# EAGLE design DroneMainBoard (EAGLE 9.6.2)

## Sheet 1 of 6
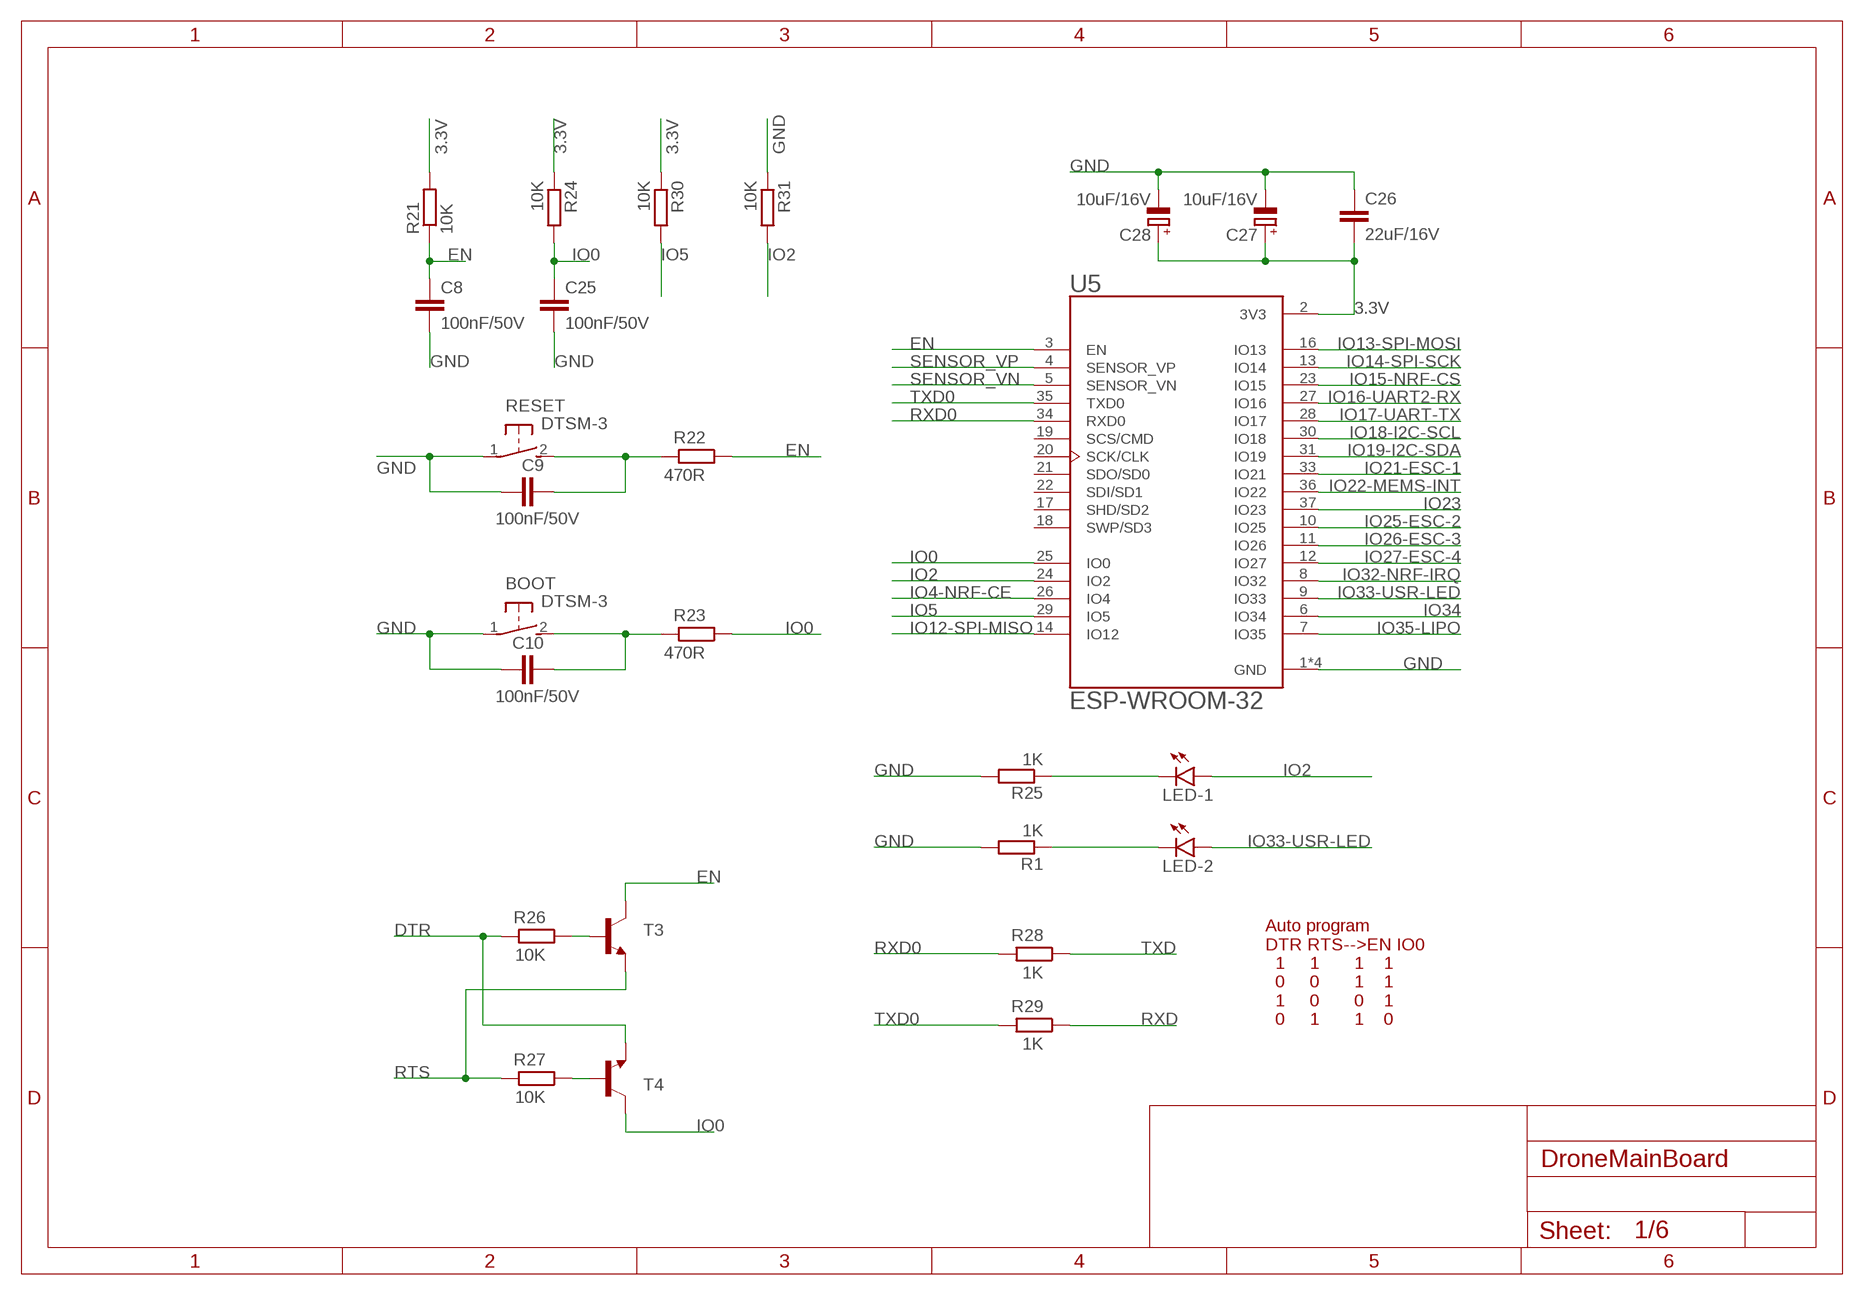
[diagram p0: schematic, sheet 1]

### Parts
BOOT  DTSM-3  [DTSM-3]
C8  100nF/50V  C-EUC0805  [C0805]
C9  100nF/50V  C-EUC0805  [C0805]
C10  100nF/50V  C-EUC0805  [C0805]
C25  100nF/50V  C-EUC0805  [C0805]
C26  22uF/16V  C-EUC0805  [C0805]
C27  10uF/16V  CPOL-EUSMCA  [SMC_A]
C28  10uF/16V  CPOL-EUSMCA  [SMC_A]
LED-1  LEDCHIP-LED0805  [CHIP-LED0805]
LED-2  LEDCHIP-LED0805  [CHIP-LED0805]
R1  1K  R-EU_R0805  [R0805]
R21  10K  R-EU_R0805  [R0805]
R22  470R  R-EU_R0805  [R0805]
R23  470R  R-EU_R0805  [R0805]
R24  10K  R-EU_R0805  [R0805]
R25  1K  R-EU_R0805  [R0805]
R26  10K  R-EU_R0805  [R0805]
R27  10K  R-EU_R0805  [R0805]
R28  1K  R-EU_R0805  [R0805]
R29  1K  R-EU_R0805  [R0805]
R30  10K  R-EU_R0805  [R0805]
R31  10K  R-EU_R0805  [R0805]
RESET  DTSM-3  [DTSM-3]
T3  -NPN-SOT23-EBC  [SOT23-EBC]
T4  -NPN-SOT23-EBC  [SOT23-EBC]
U5  ESP-WROOM-32  [MODULE_ESP-WROOM-32]

### Nets
3.3V: C26.2 C27.+ C28.+ R21.2 R24.1 R30.1 U5.2(3V3) ; also sheet 2,3,4,5,6
DTR: R26.2 T4.E ; also sheet 2
EN: C8.1 R21.1 R22.1 T3.C U5.3(EN)
GND: BOOT.1 C8.2 C9.1 C10.1 C25.2 C26.1 C27.- C28.- R1.2 R25.2 R31.1 RESET.1 U5.1(GND) U5.1.1(GND) U5.15(GND) U5.38(GND) ; also sheet 2,3,4,5,6
IO0: C25.1 R23.1 R24.2 T4.C U5.25(IO0)
IO2: LED-1.A R31.2 U5.24(IO2)
IO4-NRF-CE: U5.26(IO4) ; also sheet 3
IO5: R30.2 U5.29(IO5)
IO12-SPI-MISO: U5.14(IO12) ; also sheet 3
IO13-SPI-MOSI: U5.16(IO13) ; also sheet 3
IO14-SPI-SCK: U5.13(IO14) ; also sheet 3
IO15-NRF-CS: U5.23(IO15) ; also sheet 3
IO16-UART2-RX: U5.27(IO16)
IO17-UART-TX: U5.28(IO17)
IO18-I2C-SCL: U5.30(IO18) ; also sheet 4,5
IO19-I2C-SDA: U5.31(IO19) ; also sheet 4,5
IO21-ESC-1: U5.33(IO21) ; also sheet 6
IO22-MEMS-INT: U5.36(IO22) ; also sheet 4
IO23: U5.37(IO23)
IO25-ESC-2: U5.10(IO25) ; also sheet 6
IO26-ESC-3: U5.11(IO26) ; also sheet 6
IO27-ESC-4: U5.12(IO27) ; also sheet 6
IO32-NRF-IRQ: U5.8(IO32) ; also sheet 3
IO33-USR-LED: LED-2.A U5.9(IO33)
IO34: U5.6(IO34)
IO35-LIPO: U5.7(IO35) ; also sheet 6
N$5: LED-2.C R1.1
N$22: BOOT.2 C10.2 R23.2
N$23: R26.1 T3.B
N$24: R27.1 T4.B
N$25: LED-1.C R25.1
N$26: C9.2 R22.2 RESET.2
RTS: R27.2 T3.E ; also sheet 2
RXD: R29.1 ; also sheet 2
RXD0: R28.2 U5.34(RXD0)
SENSOR_VN: U5.5(SENSOR_VN)
SENSOR_VP: U5.4(SENSOR_VP)
TXD: R28.1 ; also sheet 2
TXD0: R29.2 U5.35(TXD0)
Unconnected: U5.17(SHD/SD2) U5.18(SWP/SD3) U5.19(SCS/CMD) U5.20(SCK/CLK) U5.21(SDO/SD0) U5.22(SDI/SD1)

### Notes on the sheet
- Auto program
  DTR RTS-->EN IO0
    1     1       1    1
    0     0       1    1
    1     0       0    1
    0     1       1    0

## Sheet 2 of 6
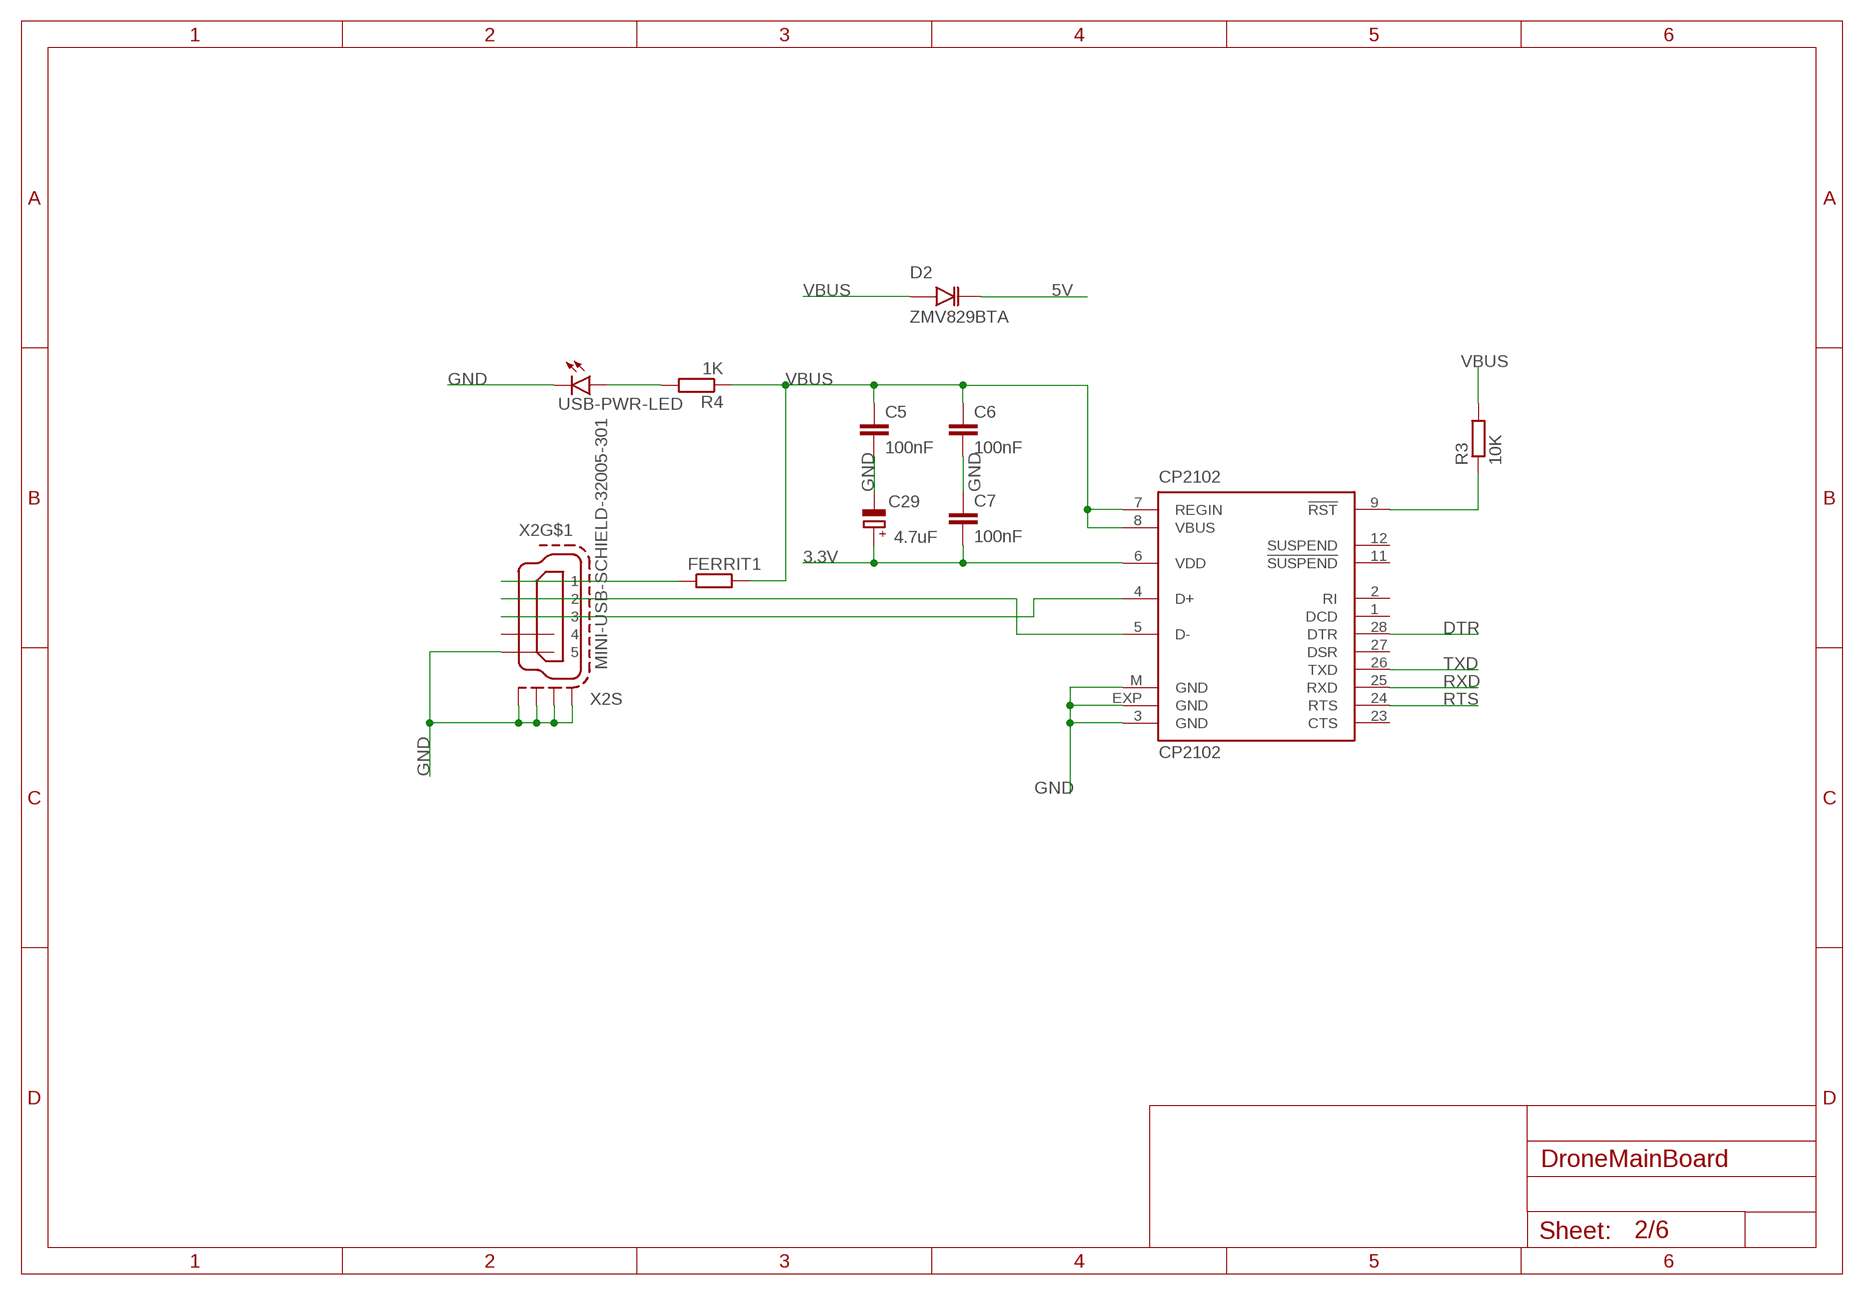
[diagram p1: schematic, sheet 2]

### Parts
C5  100nF  C-EUC0805  [C0805]
C6  100nF  C-EUC0805  [C0805]
C7  100nF  C-EUC0805  [C0805]
C29  4.7uF  CPOL-EUSMCA  [SMC_A]
CP2102  CP2102  [MLP28]
D2  ZMV829BTA  [SOD2512X116N]
FERRIT1  R-EU_R0805  [R0805]
R3  10K  R-EU_R0805  [R0805]
R4  1K  R-EU_R0805  [R0805]
USB-PWR-LED  LEDCHIPLED_0805  [CHIPLED_0805]
X2  MINI-USB-SCHIELD-32005-301  [32005-301]

### Nets
3.3V: C7.2 C29.+ CP2102.6(VDD) ; also sheet 1,3,4,5,6
5V: D2.K ; also sheet 6
DTR: CP2102.28(DTR) ; also sheet 1
GND: C5.2 C6.2 C7.1 C29.- CP2102.3(GND) CP2102.EXP(GND) CP2102.M(GND) USB-PWR-LED.C X2.5 X2.M1(S:S1) X2.M2(S:S2) X2.M3(S:S3) X2.M4(S:S4) ; also sheet 1,3,4,5,6
N$21: CP2102.9(!RST) R3.1
N$27: FERRIT1.1 X2.1
N$28: CP2102.5(D-) X2.2
N$29: CP2102.4(D+) X2.3
N$30: R4.2 USB-PWR-LED.A
RTS: CP2102.24(RTS) ; also sheet 1
RXD: CP2102.25(RXD) ; also sheet 1
TXD: CP2102.26(TXD) ; also sheet 1
VBUS: C5.1 C6.1 CP2102.7(REGIN) CP2102.8(VBUS) D2.A FERRIT1.2 R3.2 R4.1
Unconnected: CP2102.1(DCD) CP2102.2(RI) CP2102.11(!SUSPEND) CP2102.12(SUSPEND) CP2102.23(CTS) CP2102.27(DSR) X2.4

## Sheet 3 of 6
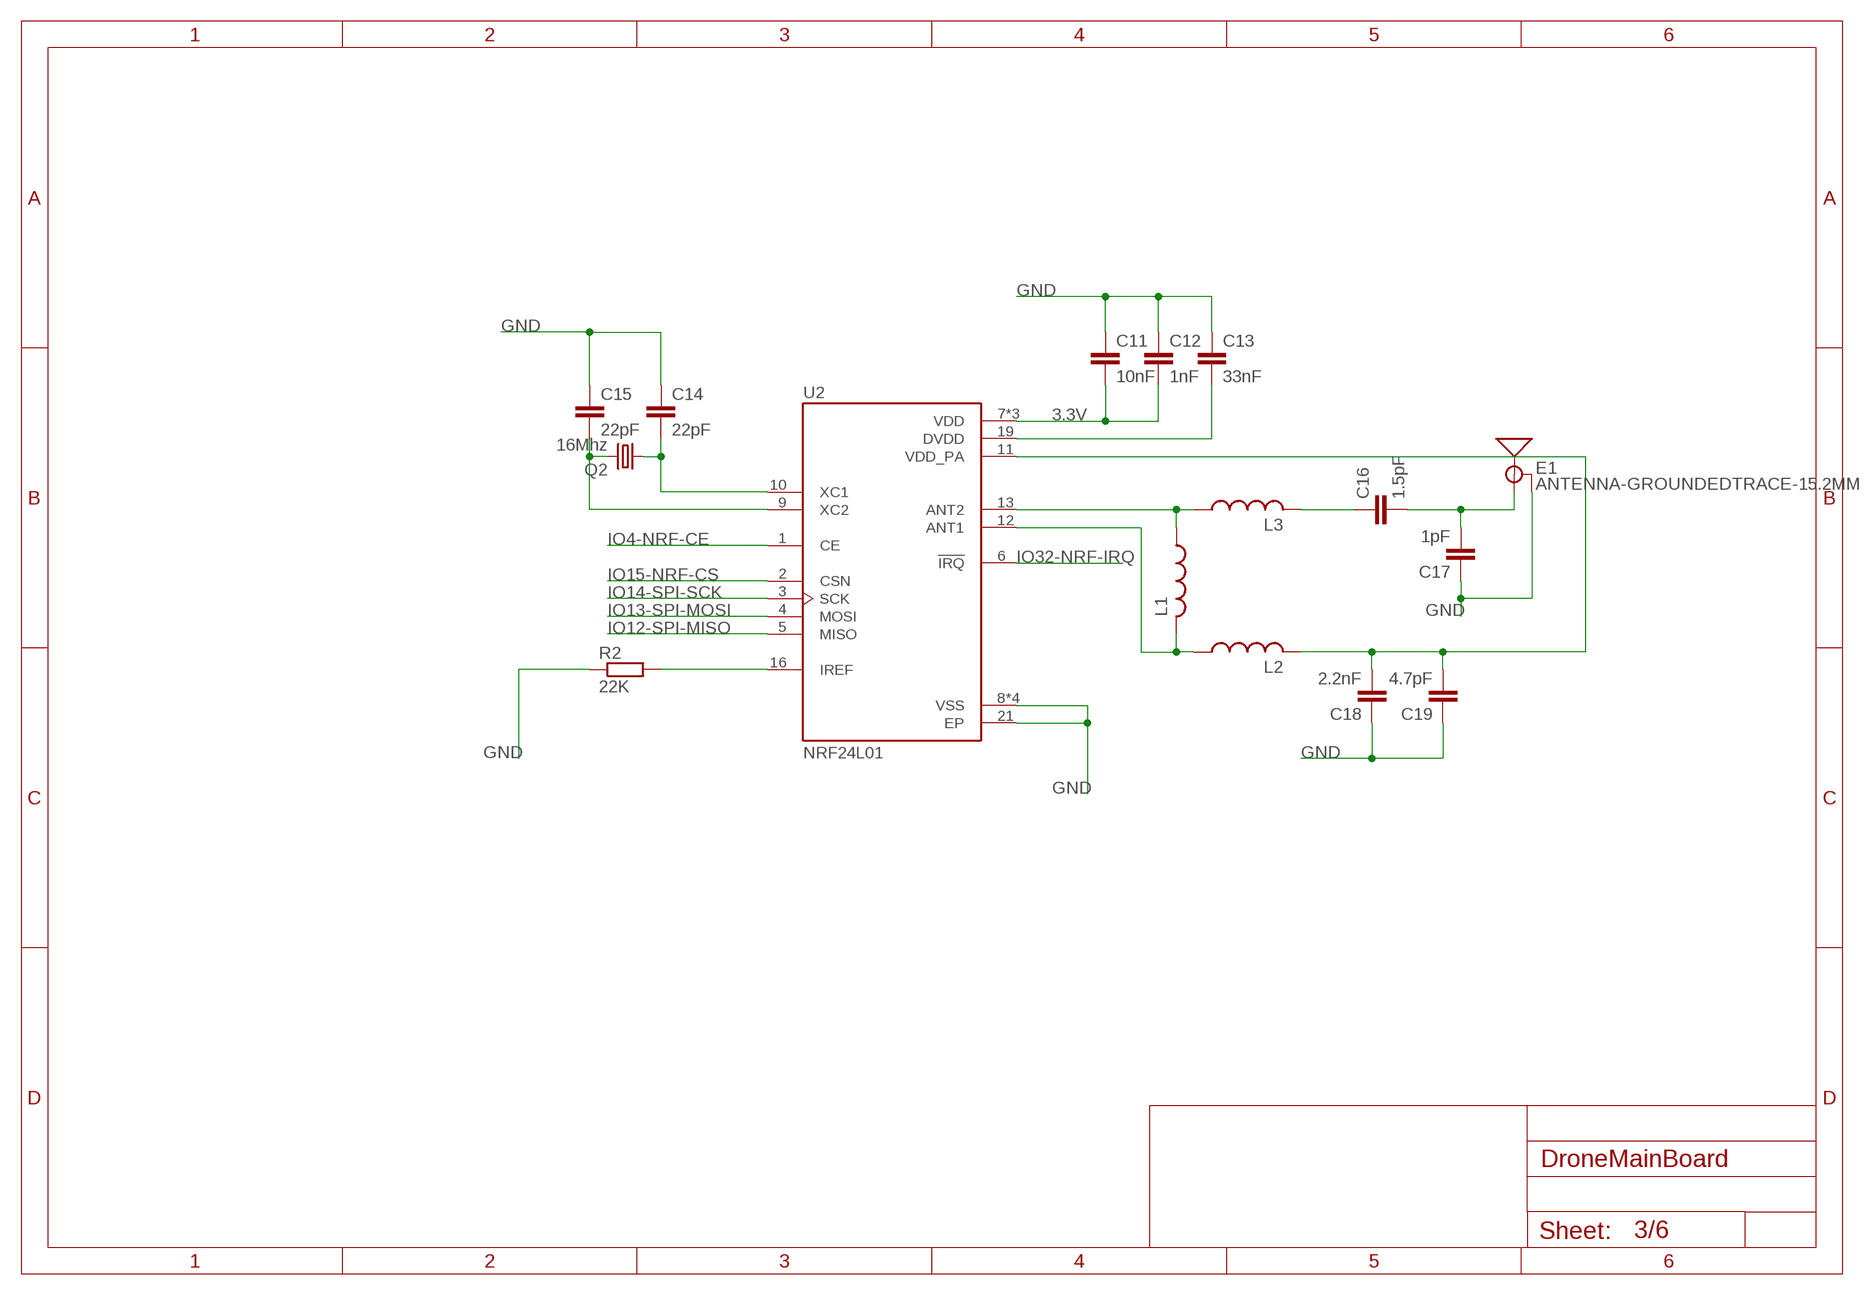
[diagram p2: schematic, sheet 3]

### Parts
C11  10nF  C-EUC0805  [C0805]
C12  1nF  C-EUC0805  [C0805]
C13  33nF  C-EUC0805  [C0805]
C14  22pF  C-EUC0805  [C0805]
C15  22pF  C-EUC0805  [C0805]
C16  1.5pF  C-EUC0805  [C0805]
C17  1pF  C-EUC0805  [C0805]
C18  2.2nF  C-EUC0805  [C0805]
C19  4.7pF  C-EUC0805  [C0805]
E1  ANTENNA-GROUNDEDTRACE-15.2MM  [TRACE_ANTENNA_2.4GHZ_15.2MM]
L1  L-USL2012C  [L2012C]
L2  L-USL2012C  [L2012C]
L3  L-USL2012C  [L2012C]
Q2  16Mhz  CRYSTALHC49S  [HC49/S]
R2  22K  R-EU_R0805  [R0805]
U2  NRF24L01  [QFN50P400X400X95-21N]

### Nets
3.3V: C11.2 C12.2 U2.7(VDD) U2.15(VDD) U2.18(VDD) ; also sheet 1,2,4,5,6
GND: C11.1 C12.1 C13.1 C14.1 C15.1 C17.1 C18.1 C19.1 E1.GND R2.1 U2.8(VSS) U2.14(VSS) U2.17(VSS) U2.20(VSS) U2.21(EP) ; also sheet 1,2,4,5,6
IO4-NRF-CE: U2.1(CE) ; also sheet 1
IO12-SPI-MISO: U2.5(MISO) ; also sheet 1
IO13-SPI-MOSI: U2.4(MOSI) ; also sheet 1
IO14-SPI-SCK: U2.3(SCK) ; also sheet 1
IO15-NRF-CS: U2.2(CSN) ; also sheet 1
IO32-NRF-IRQ: U2.6(!IRQ) ; also sheet 1
N$3: C14.2 Q2.1 U2.10(XC1)
N$4: C15.2 Q2.2 U2.9(XC2)
N$7: C16.2 C17.2 E1.ANT(SIGNAL)
N$9: R2.2 U2.16(IREF)
N$11: C13.2 U2.19(DVDD)
N$12: C18.2 C19.2 L2.2 U2.11(VDD_PA)
N$13: L1.1 L3.1 U2.13(ANT2)
N$14: L1.2 L2.1 U2.12(ANT1)
N$17: C16.1 L3.2

## Sheet 4 of 6
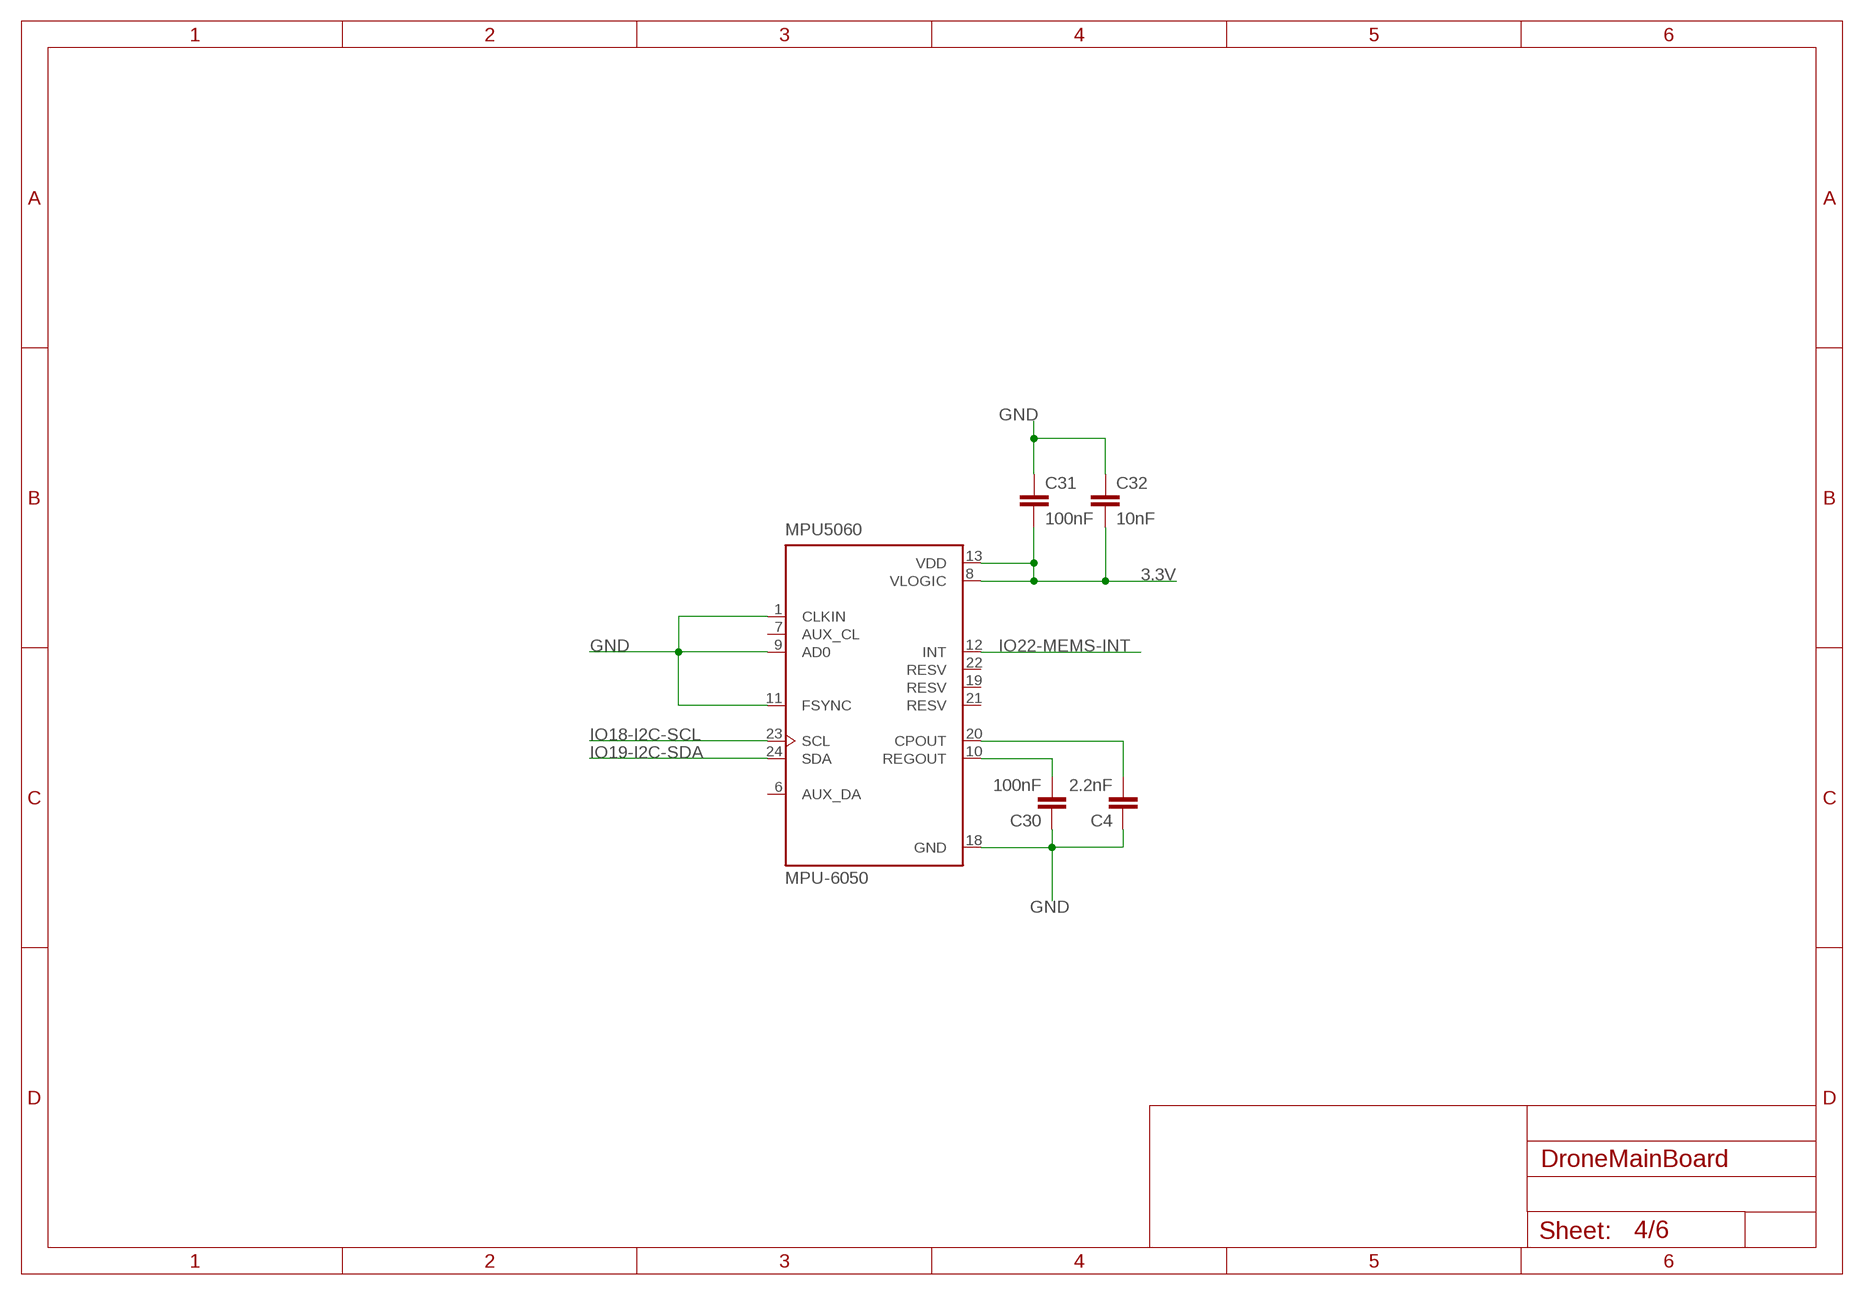
[diagram p3: schematic, sheet 4]

### Parts
C4  2.2nF  C-EUC0805  [C0805]
C30  100nF  C-EUC0805  [C0805]
C31  100nF  C-EUC0805  [C0805]
C32  10nF  C-EUC0805  [C0805]
MPU5060  MPU-6050  [QFN50P400X400X95-24N]

### Nets
3.3V: C31.2 C32.2 MPU5060.8(VLOGIC) MPU5060.13(VDD) ; also sheet 1,2,3,5,6
GND: C4.1 C30.1 C31.1 C32.1 MPU5060.1(CLKIN) MPU5060.9(AD0) MPU5060.11(FSYNC) MPU5060.18(GND) ; also sheet 1,2,3,5,6
IO18-I2C-SCL: MPU5060.23(SCL) ; also sheet 1,5
IO19-I2C-SDA: MPU5060.24(SDA) ; also sheet 1,5
IO22-MEMS-INT: MPU5060.12(INT) ; also sheet 1
N$10: C30.2 MPU5060.10(REGOUT)
N$15: C4.2 MPU5060.20(CPOUT)
Unconnected: MPU5060.6(AUX_DA) MPU5060.7(AUX_CL) MPU5060.19(RESV) MPU5060.21(RESV) MPU5060.22(RESV)

## Sheet 5 of 6
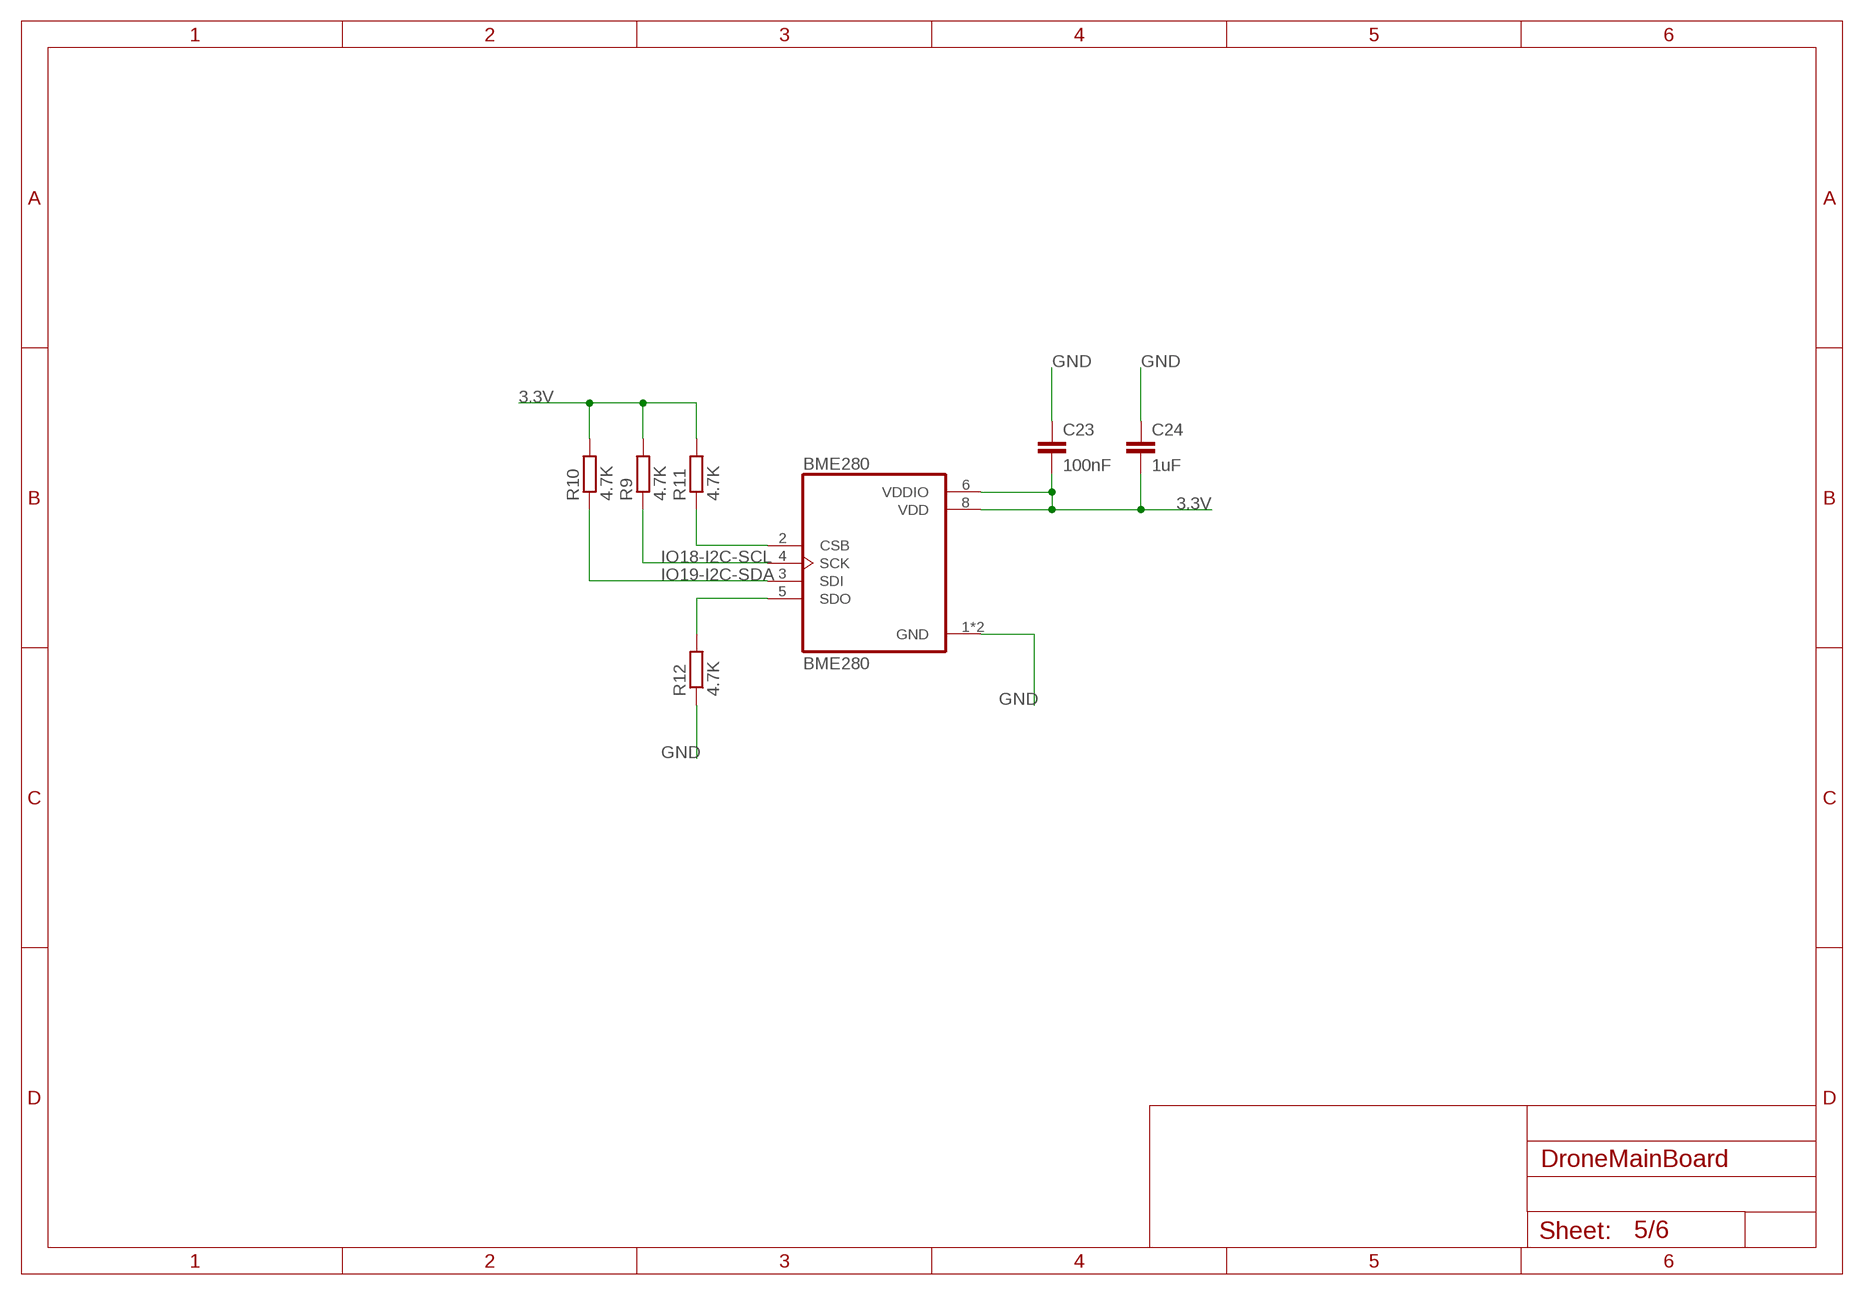
[diagram p4: schematic, sheet 5]

### Parts
BME280  BME280  [PSON65P250X250X100-8N]
C23  100nF  C-EUC0805  [C0805]
C24  1uF  C-EUC0805  [C0805]
R9  4.7K  R-EU_R0805  [R0805]
R10  4.7K  R-EU_R0805  [R0805]
R11  4.7K  R-EU_R0805  [R0805]
R12  4.7K  R-EU_R0805  [R0805]

### Nets
3.3V: BME280.6(VDDIO) BME280.8(VDD) C23.2 C24.2 R9.2 R10.2 R11.2 ; also sheet 1,2,3,4,6
GND: BME280.1(GND) BME280.7(GND) C23.1 C24.1 R12.1 ; also sheet 1,2,3,4,6
IO18-I2C-SCL: BME280.4(SCK) R9.1 ; also sheet 1,4
IO19-I2C-SDA: BME280.3(SDI) R10.1 ; also sheet 1,4
N$8: BME280.2(CSB) R11.1
N$19: BME280.5(SDO) R12.2

## Sheet 6 of 6
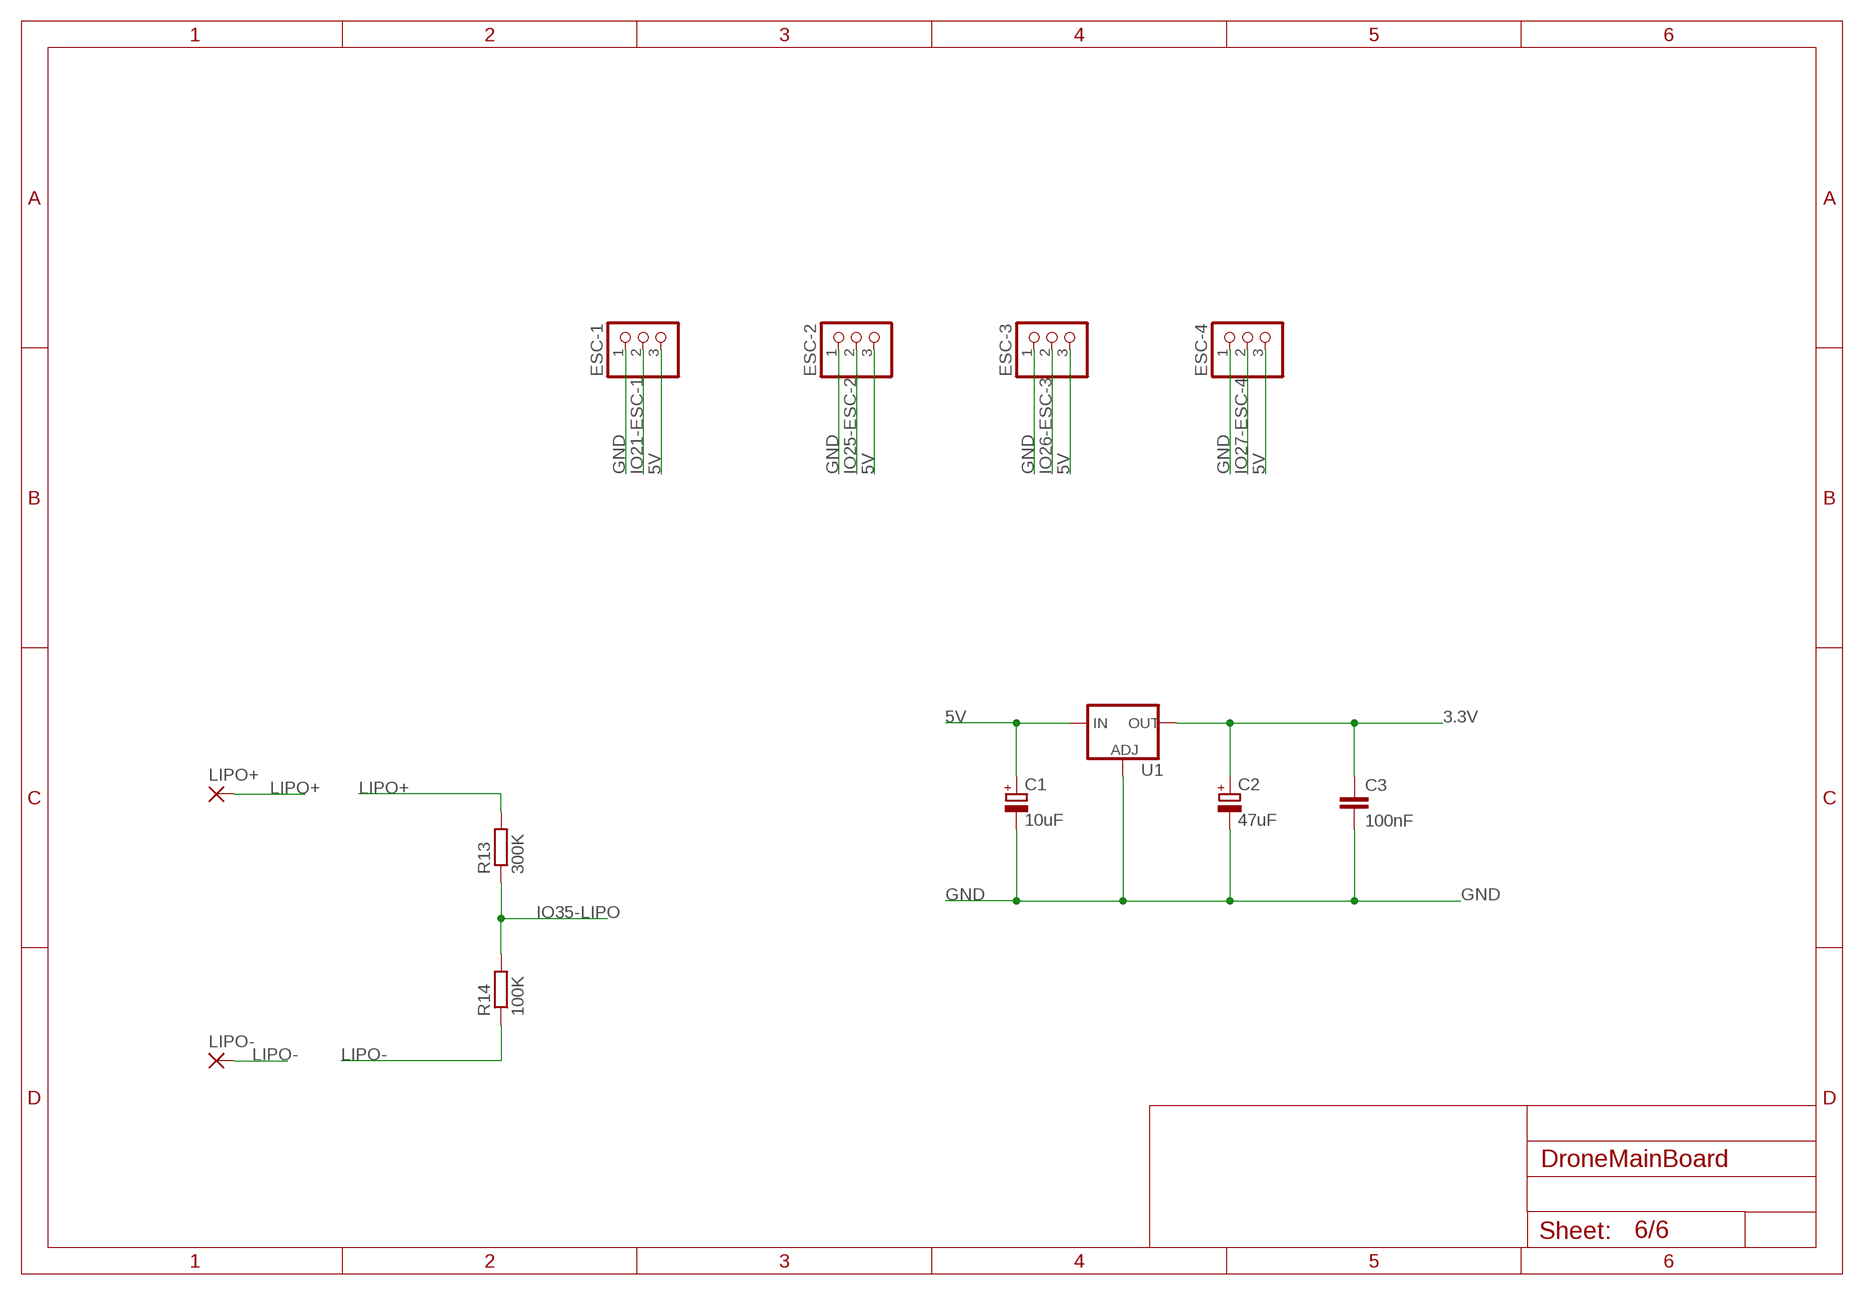
[diagram p5: schematic, sheet 6]

### Parts
C1  10uF  CPOL-EUSMCA  [SMC_A]
C2  47uF  CPOL-EUSMCA  [SMC_A]
C3  100nF  C-EUC0805  [C0805]
ESC-1  PINHD-1X3  [1X03]
ESC-2  PINHD-1X3  [1X03]
ESC-3  PINHD-1X3  [1X03]
ESC-4  PINHD-1X3  [1X03]
LIPO+  2,15/1,0  [2,15/1,0]
LIPO-  2,15/1,0  [2,15/1,0]
R13  300K  R-EU_R0805  [R0805]
R14  100K  R-EU_R0805  [R0805]
U1  V_REG_LM1117SOT223  [SOT223]

### Nets
3.3V: C2.+ C3.1 U1.2(OUT) U1.4(OUT) ; also sheet 1,2,3,4,5
5V: C1.+ ESC-1.3 ESC-2.3 ESC-3.3 ESC-4.3 U1.3(IN) ; also sheet 2
GND: C1.- C2.- C3.2 ESC-1.1 ESC-2.1 ESC-3.1 ESC-4.1 U1.1(ADJ) ; also sheet 1,2,3,4,5
IO21-ESC-1: ESC-1.2 ; also sheet 1
IO25-ESC-2: ESC-2.2 ; also sheet 1
IO26-ESC-3: ESC-3.2 ; also sheet 1
IO27-ESC-4: ESC-4.2 ; also sheet 1
IO35-LIPO: R13.1 R14.2 ; also sheet 1
LIPO+: LIPO+.1(P) R13.2
LIPO-: LIPO-.1(P) R14.1

## Library data of the parts
BME280 = BME280:BME280: DIGITAL HUMIDITY, PRESSURE AND TEMPERATURE SENSOR * Digital interface I²C (up to 3.4 MHz) and SPI (3 and 4 wire, up to 10 MHz)* Supply voltage VDD main supply voltage range: 1.71 V to 3.6 V*VDDIO interface voltage range: 1.2 V to 3.6 V Operating range -40…+85 °C, 0…100 % rel. humidity, 300…1100 hPa The library has been designed by Richard Magdycz <https://www.facebook.com/groups/eaglecadsoftUK> Check prices <https://pricing.snapeda.com/parts/BME280/Bosch/view-part?ref=eda>; AVAILABILITY: Good; DESCRIPTION: Humidity Temperature Sensor 0 ~ 100% RH I²C, SPI ±3% 1s Surface Mount; MF: Bosch; MP: BME280; PACKAGE: LGA-8 Bosch; PRICE: None; PURCHASE-URL: https://pricing.snapeda.com/search/part/BME280/?ref=eda
BOOT RESET = switch-tact:DTSM-3
C1 C2 C27-C29 = rcl:CPOL-EU: POLARIZED CAPACITOR, European symbol; SPICEPREFIX: C
C3-C19 C23-C26 C30-C32 = rcl:C-EU: CAPACITOR, European symbol; SPICEPREFIX: C
CP2102 = silabs:CP210*: Single-Chip USB to UART Bridge Source: www.silabs.com .. CP2101.pdf / cp2102.pdf; MF: FARNELL; MPN: CP2102-GM; OC_FARNELL: 9282130; OC_NEWARK: 30K5635
D2 = ZMV829BTA:ZMV829BTA: Varactors Single 25V Surface Mount SOD-323 Check prices <https://pricing.snapeda.com/search/part/ZMV829BTA/?ref=eda>; AVAILABILITY: Bad; DESCRIPTION: Varactors Single 25V Surface Mount SOD-323; MF: Diodes Inc.; MP: ZMV829BTA; PACKAGE: SOD-323 Diodes Inc.; PRICE: None
E1 = SparkFun-RF:ANTENNA-GROUNDED: Antenna w/ Ground Connection 2.4GHz antennae with signal and ground terminals. TRACE_ANTENNA_2.4GHZ_15.2MM - Meander Trace antenna 15.2 x 5.7mm footprint Based on layout from TI app note AN043 <http://www.ti.com/lit/an/swra117d/swra117d.pdf>. TRACE_ANTENNA_2.4GHZ_25.7MM - Inverted F trace antenna 25.7 x 7.5 mm footprint. Based on layout from TI design note DN0007 <http://www.ti.com/lit/an/swru120b/swru120b.pdf>.
ESC-1-ESC-4 = pinhead:PINHD-1X3: PIN HEADER
FERRIT1 R1-R4 R9-R14 R21-R31 = rcl:R-EU_: RESISTOR, European symbol; SPICEPREFIX: R
L1-L3 = rcl:L-US: INDUCTOR, American symbol; SPICEPREFIX: L
LED-1 LED-2 USB-PWR-LED = led:LED: LED OSRAM: - CHIPLED LG R971, LG N971, LY N971, LG Q971, LY Q971, LO R971, LY R971 LH N974, LH R974 LS Q976, LO Q976, LY Q976 LO Q996 - Hyper CHIPLED LW Q18S LB Q993, LB Q99A, LB R99A - SideLED LS A670, LO A670, LY A670, LG A670, LP A670 LB A673, LV A673, LT A673, LW A673 LH A674 LY A675 LS A676, LA A676, LO A676, LY A676, LW A676 LS A679, LY A679, LG A679 - Hyper Micro SIDELED® LS Y876, LA Y876, LO Y876, LY Y876 LT Y87S - SmartLED LW L88C, LW L88S LB L89C, LB L89S, LG L890 LS L89K, LO L89K, LY L89K LS L896, LA L896, LO L896, LY L896 - TOPLED LS T670, LO T670, LY T670, LG T670, LP T670 LSG T670, LSP T670, LSY T670, LOP T670, LYG T670 LG T671, LOG T671, LSG T671 LB T673, LV T673, LT T673, LW T673 LH T674 LS T676, LA T676, LO T676, LY T676, LB T676, LH T676, LSB T676, LW T676 LB T67C, LV T67C, LT T67C, LS T67K, LO T67K, LY T67K, LW E67C LS E67B, LA E67B, LO E67B, LY E67B, LB E67C, LV E67C, LT E67C LW T67C LS T679, LY T679, LG T679 LS T770, LO T770, LY T770, LG T770, LP T770 LB T773, LV T773, LT T773, LW T773 LH T774 LS E675, LA E675, LY E675, LS T675 LS T776, LA T776, LO T776, LY T776, LB T776 LHGB T686 LT T68C, LB T68C - Hyper Mini TOPLED® LB M676 - Mini TOPLED Santana® LG M470 LS M47K, LO M47K, LY M47K Source: http://www.osram.convergy.de LUXEON: - LUMILED® LXK2-PW12-R00, LXK2-PW12-S00, LXK2-PW14-U00, LXK2-PW14-V00 LXK2-PM12-R00, LXK2-PM12-S00, LXK2-PM14-U00 LXK2-PE12-Q00, LXK2-PE12-R00, LXK2-PE12-S00, LXK2-PE14-T00, LXK2-PE14-U00 LXK2-PB12-K00, LXK2-PB12-L00, LXK2-PB12-M00, LXK2-PB14-N00, LXK2-PB14-P00, LXK2-PB14-Q00 LXK2-PR12-L00, LXK2-PR12-M00, LXK2-PR14-Q00, LXK2-PR14-R00 LXK2-PD12-Q00, LXK2-PD12-R00, LXK2-PD12-S00 LXK2-PH12-R00, LXK2-PH12-S00 LXK2-PL12-P00, LXK2-PL12-Q00, LXK2-PL12-R00 Source: www.luxeon.com KINGBRIGHT: KA-3528ASYC Source: www.kingbright.com
LIPO+ LIPO- = wirepad:2,15/1,0: THROUGH-HOLE PAD
MPU5060 = MPU-6050:MPU-6050: MPU-6050 Six-Axis (Gyro + Accelerometer) MEMS MotionTracking™ Devices Check prices <https://pricing.snapeda.com/parts/MPU-6050/TDK%20InvenSense/view-part?ref=eda>; AVAILABILITY: Warning; DESCRIPTION: Accelerometer, Gyroscope, 6 Axis Sensor I²C Output; MF: TDK InvenSense; MP: MPU-6050; PACKAGE: VFQFN-24 TDK InvenSense; PRICE: None; PURCHASE-URL: https://pricing.snapeda.com/search/part/MPU-6050/?ref=eda
Q2 = crystal:CRYSTAL: CRYSTAL; OC_FARNELL: 1667008; OC_NEWARK: unknown
T3 T4 = transistor:*-NPN-: NPN Transistror BF959 corrected 2008.03.06
U1 = SparkFun-IC-Power:V_REG_LM1117: Voltage Regulator LM1117 Standard adjustable voltage regulator but in SMD form. Spark Fun Electronics SKU : COM-00595; PROD_ID: VREG-08170
U2 = NRF24L01:NRF24L01: The nRF24L01 is a single chip 2.4GHz transceiver with an embedded baseband protocol engine (Enhanced ShockBurst™), designed for ultra low power wireless applications. The nRF24L01 is designed for operation in the world wide ISM frequency band at 2.400 - 2.4835GHz. An MCU (microcontroller) and very few external passive components are needed to design a radio system with the nRF24L01. The nRF24L01 is configured and operated through a Serial Peripheral Interface (SPI.) Through this interface the register map is available. The register map contains all configuration registers in the nRF24L01 and is accessible in all operation modes of the chip. Buy Part <https://snapeda.com/parts/NRF24L01/Nordic/view-part/?ref=eda>; AVAILABILITY: Warning; DESCRIPTION: IC RF TxRx Only General ISM > 1GHZ 2.4GHz 20-VFQFN Exposed Pad; MF: Nordic; MOUSER-PURCHASE-URL: https://snapeda.com/shop?store=Mouser&id=44833; MP: NRF24L01; PACKAGE: VFQFN-20 Nordic Semiconductor; PRICE: None
U5 = ESP-WROOM-32:ESP-WROOM-32: Module: combo; GPIO, I2C x2, I2S x2, SDIO, SPI x3, UART x3; 19.5dBm; AVAILABILITY: Unavailable; DESCRIPTION: WiFi 802.11b/g/n/d/e/i Transceiver Module 2.4GHz Surface Mount; MF: Olimex LTD; MP: ESP-WROOM-32; PACKAGE: Module Olimex LTD; PRICE: None
X2 = con-cypressindustries:MINI-USB-SCHIELD-: MINI USB-B Conector Source: www.cypressindustries.com; OC_FARNELL: unknown; OC_NEWARK: unknown

## Board
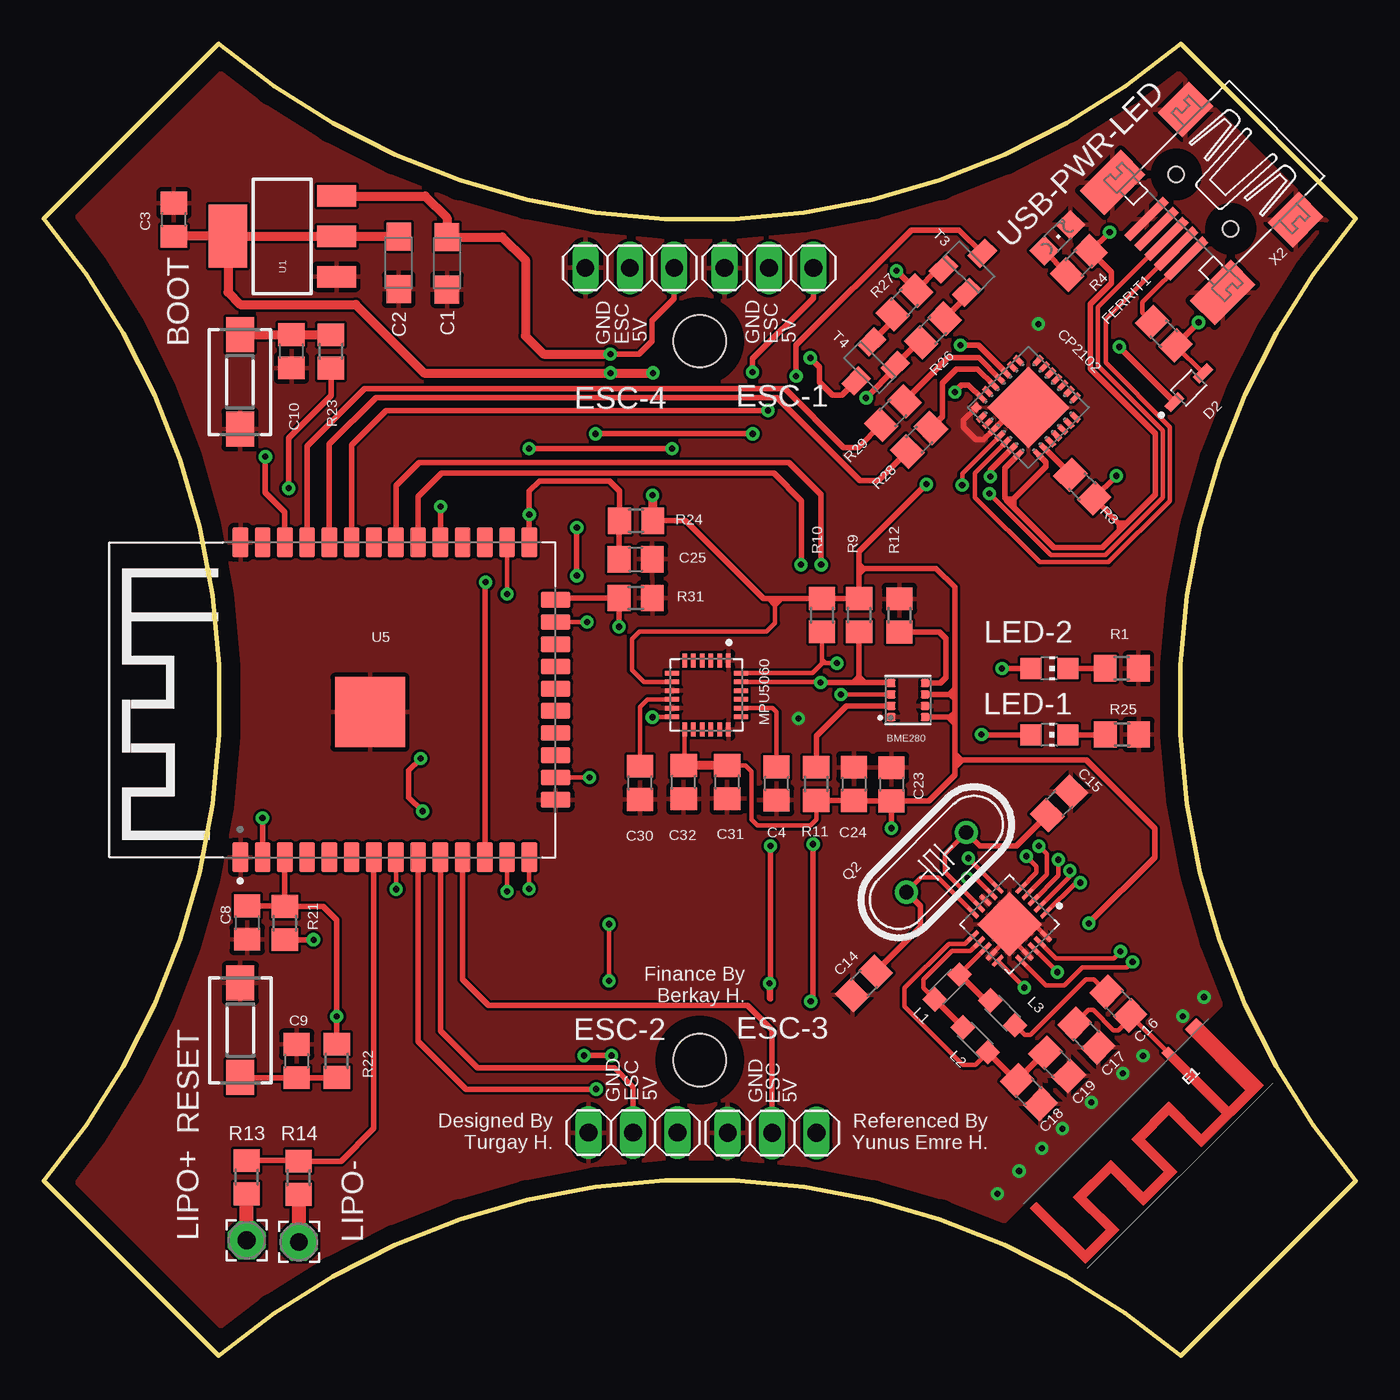
[diagram p6: board, top side]
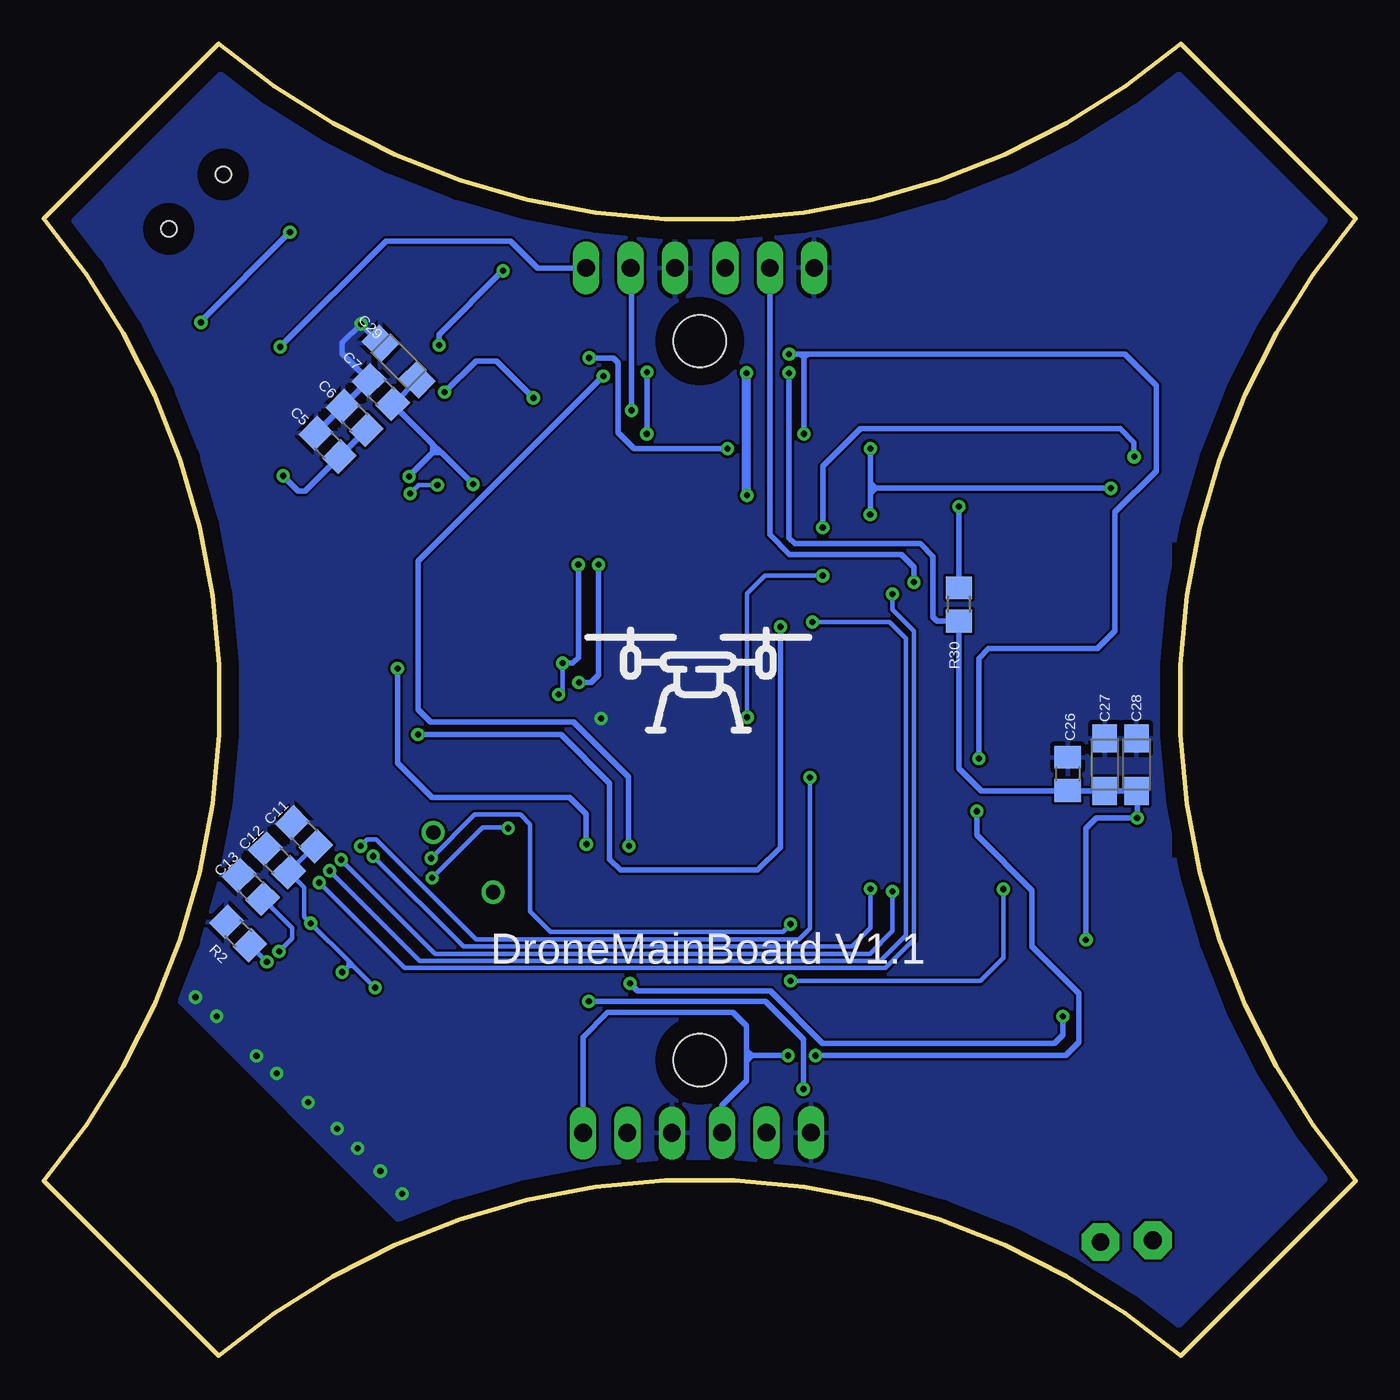
[diagram p7: board, bottom side, seen from below]

Size 75 x 75 mm. Coordinates in mm from the lower left corner, seen from the top.
Outline: 0,10 10,0 arc-80 65,0 75,10 arc-80 75,65 65,75 arc-80 10,75 0,65 arc-80 0,10
Copper layers (1*16): Top 0.035mm / dielectric 1.5mm / Bottom 0.035mm
Design rules "default": minimum track width 6mil, minimum drill 0.35mm, track to track 6mil, track to pad 6mil, pad to pad 6mil, via to via 6mil, smd to smd 6mil, copper to edge 40mil, drill to drill 6mil, minimum pad ring 10mil, minimum via ring 8mil, stop-mask expansion 4mil, vias tented up to drill 0mil, thermal gap 10mil
Holes 3 mm at 37.5,58 37.5,16.9
bKeepout: 1 lines
tRestrict: 1 lines
bRestrict: 1 lines

### Footprints (pad centres in the part's own frame; a part is rotated, then mirrored left to right if it is on the bottom)
PSON65P250X250X100-8N = smd 0.49 x 0.45: 1 0.97,0.975; 2 0.97,0.325; 3 0.97,-0.325; 4 0.97,-0.975; 5 -0.97,-0.975; 6 -0.97,-0.325; 7 -0.97,0.325; 8 -0.97,0.975
DTSM-3 = smd 2 x 1.6: 1 -2.7,0; 2 2.7,0
SMC_A = smd 1.6 x 1.4: + -1.5,0; - 1.5,0
C0805 = smd 1.3 x 1.5: 1 -0.95,0; 2 0.95,0
MLP28 = smd 0.6 x 0.3: 1 -2.3,1.5; 2 -2.3,1; 3 -2.3,0.5; 4 -2.3,0; 5 -2.3,-0.5; 6 -2.3,-1; 7 -2.3,-1.5; 15 2.3,-1.5; 16 2.3,-1; 17 2.3,-0.5; 18 2.3,0; 19 2.3,0.5; 20 2.3,1; 21 2.3,1.5 | smd 0.3 x 0.6: 8 -1.5,-2.3; 9 -1,-2.3; 10 -0.5,-2.3; 11 0,-2.3; 12 0.5,-2.3; 13 1,-2.3; 14 1.5,-2.3; 22 1.5,2.3; 23 1,2.3; 24 0.5,2.3; 25 0,2.3; 26 -0.5,2.3; 27 -1,2.3; 28 -1.5,2.3 | smd 3.3 x 3.3: EXP 0,0 | smd 0.435 x 0.435: M -2.103,2.103
SOD2512X116N = smd 1.11 x 0.52: A 1.165,0; K -1.165,0
TRACE_ANTENNA_2.4GHZ_15.2MM = smd 0.5 x 0.5: ANT 0,-0.25 | smd 0.9 x 0.5: GND -2.1,-0.25
1X03 = drill 1.016 long: 1 -2.54,0; 2 0,0; 3 2.54,0
R0805 = smd 1.3 x 1.5: 1 -0.95,0; 2 0.95,0
L2012C = smd 1 x 1: 1 -1,0; 2 1,0
CHIP-LED0805 = smd 1.2 x 1.2: A 0,-1.05; C 0,1.05
2,15/1,0 = drill 1.016 pad 2.159 octagon: 1 0,0
QFN50P400X400X95-24N = smd 0.79 x 0.26: 1 -1.97,1.25; 2 -1.97,0.75; 3 -1.97,0.25; 4 -1.97,-0.25; 5 -1.97,-0.75; 6 -1.97,-1.25; 13 1.97,-1.25; 14 1.97,-0.75; 15 1.97,-0.25; 16 1.97,0.25; 17 1.97,0.75; 18 1.97,1.25 | smd 0.26 x 0.79: 7 -1.25,-1.97; 8 -0.75,-1.97; 9 -0.25,-1.97; 10 0.25,-1.97; 11 0.75,-1.97; 12 1.25,-1.97; 19 1.25,1.97; 20 0.75,1.97; 21 0.25,1.97; 22 -0.25,1.97; 23 -0.75,1.97; 24 -1.25,1.97
HC49/S = drill 0.813: 1 -2.413,0; 2 2.413,0
SOT23-EBC = smd 1 x 1.4: B 0.95,-1.1; C 0,1.1; E -0.95,-1.1
SOT223 = smd 1.219 x 2.235: 1 -2.311,-3.099; 2 0,-3.099; 3 2.311,-3.099 | smd 3.6 x 2.2: 4 0,3.099
QFN50P400X400X95-21N = smd 0.81 x 0.26: 1 -1.95,1; 2 -1.95,0.5; 3 -1.95,0; 4 -1.95,-0.5; 5 -1.95,-1; 11 1.95,-1; 12 1.95,-0.5; 13 1.95,0; 14 1.95,0.5; 15 1.95,1 | smd 0.26 x 0.81: 6 -1,-1.95; 7 -0.5,-1.95; 8 0,-1.95; 9 0.5,-1.95; 10 1,-1.95; 16 1,1.95; 17 0.5,1.95; 18 0,1.95; 19 -0.5,1.95; 20 -1,1.95 | smd 2.6 x 2.6: 21 0,0
MODULE_ESP-WROOM-32 = smd 1.7 x 0.9: 1 -9,8.255; 2 -9,6.985; 3 -9,5.715; 4 -9,4.445; 5 -9,3.175; 6 -9,1.905; 7 -9,0.635; 8 -9,-0.635; 9 -9,-1.905; 10 -9,-3.175; 11 -9,-4.445; 12 -9,-5.715; 13 -9,-6.985; 14 -9,-8.255; 25 9,-8.255; 26 9,-6.985; 27 9,-5.715; 28 9,-4.445; 29 9,-3.175; 30 9,-1.905; 31 9,-0.635; 32 9,0.635; 33 9,1.905; 34 9,3.175; 35 9,4.445; 36 9,5.715; 37 9,6.985; 38 9,8.255 | smd 4 x 4: 1.1 -0.7,0.845 | smd 0.9 x 1.7: 15 -5.715,-9.755; 16 -4.445,-9.755; 17 -3.175,-9.755; 18 -1.905,-9.755; 19 -0.635,-9.755; 20 0.635,-9.755; 21 1.905,-9.755; 22 3.175,-9.755; 23 4.445,-9.755; 24 5.715,-9.755
CHIPLED_0805 = smd 1.2 x 1.2: A 0,-1.05; C 0,1.05
32005-301 = smd 3.1 x 0.5: 1 3,1.6; 2 3,0.8; 3 3,0; 4 3,-0.8; 5 3,-1.6 | smd 2.5 x 2: M1 -3,-4.45; M2 -3,4.45 | smd 3.3 x 2: M3 2.9,4.45; M4 2.9,-4.45 | hole 0.9: 0,2.2; 0,-2.2

### Placement (x,y rotation side)
BME280  49.41,37.48 180 top
BOOT  11.22,55.67 90 top
C1  23.05,62.45 270 top
C2  20.29,62.47 270 top
C3  7.44,64.94 90 top
C4  41.89,32.71 90 top
C5  58.77,52.07 135 bottom
C6  57.22,53.61 135 bottom
C7  55.73,55.08 315 bottom
C8  11.63,24.76 270 top
C9  14.45,16.85 270 top
C10  14.16,57.42 90 top
C11  60.12,29.81 315 bottom
C12  61.67,28.32 315 bottom
C13  63.16,26.81 315 bottom
C14  46.89,21.29 45 top
C15  58.04,31.58 225 top
C16  61.43,20.13 315 top
C17  59.61,18.3 135 top
C18  56.31,15.07 135 top
C19  57.93,16.66 135 top
C23  48.46,32.67 270 top
C24  46.31,32.69 270 top
C25  33.83,45.53 0 top
C26  16.47,33.26 270 bottom
C27  14.35,33.79 90 bottom
C28  12.54,33.8 90 bottom
C29  54.71,56.84 135 bottom
C30  34.09,32.75 90 top
C31  39.07,32.8 90 top
C32  36.58,32.79 90 top
CP2102  56.28,54.21 45 top
D2  65.45,55.33 45 top
E1  64.45,17.13 225 top
ESC-1  41.46,62.18 0 top
ESC-2  33.69,12.75 0 top
ESC-3  41.64,12.74 0 top
ESC-4  33.5,62.19 0 top
FERRIT1  64.02,58.42 315 top
L1  51.64,21.08 225 top
L2  53.25,18.06 315 top
L3  54.82,19.6 315 top
LED-1  57.48,35.5 270 top
LED-2  57.49,39.29 270 top
LIPO+  11.6,6.61 0 top
LIPO-  14.59,6.5 0 top
MPU5060  37.88,37.77 270 top
Q2  51.03,28.21 45 top
R1  61.62,39.3 0 top
R2  63.89,24.14 315 bottom
R3  59.36,49.69 315 top
R4  59.17,62.47 225 top
R9  46.61,42.34 90 top
R10  44.49,42.33 90 top
R11  44.16,32.69 270 top
R12  48.91,42.32 270 top
R13  11.6,10.21 270 top
R14  14.57,10.18 90 top
R21  13.78,24.73 270 top
R22  16.75,16.86 270 top
R23  16.42,57.41 90 top
R24  33.86,47.73 180 top
R25  61.64,35.52 0 top
R26  50.82,58.61 225 top
R27  49.2,60.21 45 top
R28  50.04,52.36 225 top
R29  48.54,53.89 225 top
R30  22.69,42.95 90 bottom
R31  33.84,43.32 180 top
RESET  11.24,18.61 270 top
T3  52.88,62.24 315 top
T4  47.22,56.5 135 top
U1  13.64,63.99 90 top
U2  55.21,24.66 225 top
U5  19.5,37.5 90 top
USB-PWR-LED  57.94,63.91 315 top
X2  66.3,65.97 225 top

### Tracks (layer width: path | path; a pad name or v marks a point on that pad's centre or on a via)
3.3V  (via drill 0.35)
  Top 0.254: 56.06,21.05 U2.15 | v57.94,21.93 U2.18 | U2.7 53.27,27.31 52.82,27.31 | MPU5060.13 36.63,33.79 | 36.71,33.87 36.63,33.79 | 36.63,33.79 C32.2 | MPU5060.8 34.3,38.52 33.62,39.2 33.62,40.96 34.05,41.39 41.3,41.39 41.8,41.89 41.8,42.9 | 41.8,43.28 41.8,42.9 | 41.8,42.9 41.42,43.28 | 41.8,42.9 42.08,43.18 42.08,43.28 | C31.2 40.1,33.75 40.46,33.39 40.46,30.65 40.79,30.32 43.82,30.32 44.16,30.66 R11.2
  Top 0.305: CP2102.6 54.12,50.63 54.12,50.29 | R9.2 R10.2 42.08,43.28 41.8,43.28 41.42,43.28 41.13,43.28 36.68,47.73 R24.1 | R9.2 | 15.4,23.78 R21.2 | 12.52,30.73 U5.2 | BME280.6 51.81,37.8 | 52.08,37.53 51.81,37.8 | 52.08,37.53 52.08,36.78 | 52.08,36.78 52.08,36.48 | 52.08,36.48 52.08,36.15 | 52.08,36.15 52.08,34.4 | 52.08,34.4 52.08,34.05 | 52.08,34.05 52.08,33.65 | 52.08,33.65 52.08,33.21 50.59,31.72 C23.2 | BME280.8 51.8,36.5 | 51.8,36.5 52.06,36.5 52.08,36.48 | 51.8,36.5 52.08,36.78 | 51.8,36.5 51.8,36.43 52.08,36.15 | 52.08,34.05 52.43,34.05 | 52.48,34.05 59.59,34.05 63.51,30.13 63.51,28.49 v59.75,24.73 | 52.48,34.05 52.43,34.05 | 52.43,34.05 52.08,34.4 | 52.48,34.05 52.08,33.65 | 52.08,37.53 52.08,38.11 | 52.08,38.11 52.08,43.94 51.01,45.01 46.89,45.01 | 46.89,45.01 46.6,44.72 | 46.6,44.72 R9.2 | 51.81,37.8 51.81,37.84 52.08,38.11 | v50.45,49.81 46.6,45.96 46.6,45.23 | 46.6,45.23 46.6,44.72 | 46.89,45.01 46.82,45.01 46.6,45.23 | C23.2 46.33,31.72 C24.2 R11.2 | 48.46,30.18 C23.2
  Top 0.508: U1.4 C3.1 | U1.4 U1.2 20.27,63.99 C2.+ | U1.4 10.54,60.79 11.24,60.09 17.83,60.09 21.74,56.18 v32.4,56.18 | 32.42,56.18 34.81,56.18 | 34.8,49.17 R24.1 | C31.2 36.83,33.75 36.71,33.87
  Top 0.61: v34.83,56.18 34.81,56.18 | v32.4,56.18 32.42,56.18 | v54.12,50.26 54.12,50.29 | v50.46,49.82 v50.45,49.81 | v34.8,49.19 34.8,49.17 | v12.5,30.74 12.52,30.73 | v15.42,23.78 15.4,23.78 | v52.8,27.31 52.82,27.31 | v59.74,24.73 v59.75,24.73 | v57.95,21.93 v57.94,21.93 | v56.06,21.04 56.06,21.05 | v48.46,30.16 48.46,30.18
  Bottom 0.254: 56.08,21.05 57.31,22.3 | 57.31,22.3 57.47,22.45 | 57.47,22.45 57.59,22.57 | 59.7,24.68 57.59,22.57 | v59.74,24.73 60.12,25.1 60.12,26.77 C12.2 59.51,29.14 C11.2 | v57.95,21.93 57.59,22.3 | 57.59,22.3 57.47,22.41 57.47,22.45 | 57.59,22.3 57.31,22.3 | 57.59,22.3 57.59,22.57 | v52.79,27.32 49.92,30.19 48.49,30.19
  Bottom 0.305: 54.1,50.27 52.76,51.62 | 52.76,52.12 C7.2 55.01,54.41 C29.+ | 52.76,52.12 52.76,51.62 | 12.5,30.76 12.5,32.26 C28.+ C27.+ 16.45,32.29 | 16.45,32.29 C26.2 | 15.42,23.8 15.42,30.15 14.83,30.74 v12.5,30.74 | 16.45,32.29 21.4,32.29 22.69,33.58 R30.1 23.93,42 24.17,42.24 24.17,45.7 24.89,46.42 32.07,46.42 32.39,46.74 v32.39,56.17 | 52.76,52.12 52.26,51.62 | v50.47,49.82 52.26,51.62 | 52.76,51.62 52.26,51.62
  Bottom 0.508: 34.83,49.22 v34.83,56.18
  Bottom 0.61: v32.4,56.18 v32.39,56.17 | v34.8,49.19 34.83,49.22 | v52.8,27.31 v52.79,27.32 | v59.74,24.73 59.7,24.68 | v57.95,21.93 | v56.06,21.04 56.08,21.05 | v15.42,23.78 15.42,23.8 | v12.5,30.74 12.5,30.76 | v54.12,50.26 54.1,50.27 | v50.46,49.82 v50.47,49.82 | v48.46,30.16 48.49,30.19
5V  (via drill 0.35)
  Top 0.305: 61.49,57.65 D2.K | 44,62.16 44,60.47 40.52,56.99 v40.52,56.24 | 31.6,52.7 40.5,52.7 | 32.41,57.26 34.04,57.26 34.77,57.99 34.77,59.17 36.04,60.44 36.04,62.16 | 21.54,34.12 20.87,33.45 20.87,31.92 v21.65,31.14 | 30.92,17.16 32.43,17.16
  Top 0.508: U1.3 21.8,66.3 23.05,65.05 C1.+ 26.21,63.95 27.53,62.63 27.53,58.3 28.57,57.26 v32.39,57.26
  Top 0.61: v32.39,57.26 32.41,57.26 | v40.52,56.23 v40.52,56.24 | v61.49,57.67 61.49,57.65 | v40.53,52.7 40.5,52.7 | v31.55,52.7 31.6,52.7 | v21.54,34.14 21.54,34.12 | v21.66,31.13 v21.65,31.14 | v32.45,17.16 32.43,17.16 | v30.89,17.16 30.92,17.16
  Top 1.27: ESC-1.3 44,62.16 | ESC-4.3 36.04,62.16
  Bottom 0.305: v61.48,57.68 55.44,63.72 48.32,63.72 46.78,62.18 44.02,62.18 | v40.52,56.22 v40.52,52.71 | 31.55,52.72 31.55,57.05 | 31.76,57.26 32.37,57.26 | 31.76,57.26 31.55,57.05 | 36.23,12.79 36.23,14.32 34.83,15.72 34.83,16.85 | 44.18,12.83 44.18,18.21 42.76,19.63 35.59,19.63 34.83,18.87 34.83,17.47 | 34.83,16.85 34.83,17.03 | 34.83,17.03 34.83,17.47 | 31.76,57.26 31.32,57.26 | 31.32,57.26 13.21,57.26 11.41,55.46 11.41,50.58 13.77,48.22 13.77,41.43 14.78,40.42 20.99,40.42 21.54,39.87 21.54,34.17 | 21.66,31.09 21.66,29.76 18.51,26.61 18.51,23.4 15.82,20.71 15.82,17.92 16.58,17.16 30.87,17.16 | 34.83,17.03 34.7,17.16 34.52,17.16 | 32.51,17.16 34.52,17.16 | 34.52,17.16 34.83,17.47 | 34.52,17.16 34.83,16.85 | 31.55,57.05 31.53,57.05 31.32,57.26
  Bottom 0.61: v31.55,52.7 31.55,52.72 | v40.53,52.7 v40.52,52.71 | v40.52,56.23 v40.52,56.22 | v61.49,57.67 v61.48,57.68 | v32.39,57.26 32.37,57.26 | v21.66,31.13 21.66,31.09 | v21.54,34.14 21.54,34.17 | v30.89,17.16 30.87,17.16 | v32.45,17.16 32.51,17.16
  Bottom 1.27: ESC-1.3 44.02,62.18 | ESC-2.3 36.23,12.79 | ESC-3.3 44.18,12.83
DTR  (via drill 0.35)
  Top 0.305: CP2102.28 52.87,55.5 52.47,55.5 52.09,55.12 | v47.02,54.77 48.67,56.42 T4.E 50,57.94 R26.2
  Top 0.61: v47.01,54.76 v47.02,54.77 | v52.09,55.08 52.09,55.12
  Bottom 0.305: 52.06,55.11 50.3,56.87 49.12,56.87 v47.02,54.77
  Bottom 0.61: v47.01,54.76 v47.02,54.77 | v52.09,55.08 52.06,55.11
EN  (via drill 0.35)
  Top 0.305: C8.1 13.75,25.71 R21.1 | R21.1 U5.3 | 16.75,19.37 R22.1 | v16.75,19.4 16.75,24.92 15.98,25.69 R21.1 | T3.C 52.33,64.35 49.59,64.35 43.01,57.77 43.01,56.04 | 41.55,29.11 41.55,20.4 41.48,20.47 v41.48,21.28
  Top 0.61: v43.01,56 43.01,56.04 | v16.75,19.4 16.75,19.37 | v41.55,29.14 41.55,29.11
  Bottom 0.305: v43.02,55.99 53.59,45.42 53.59,36.93 52.89,36.23 44.72,36.23 41.58,33.09 41.58,29.17 | 41.47,21.27 41.05,20.85 33.47,20.85 30.48,17.86 17.24,17.86 16.75,18.35 16.75,19.37
  Bottom 0.61: v43.01,56 v43.02,55.99 | v41.55,29.14 41.58,29.17 | v16.75,19.4 16.75,19.37 | v41.48,21.28 41.47,21.27
GND  (via drill 0.35)
  Top 0.254: U2.14 55.22,23.97 | U2.21 | 55.22,23.97 U2.21 | U2.17 55.22,23.94 55.22,23.97 | U2.20 56.48,24.8 55.37,24.8 U2.21
  Top 0.305: CP2102.EXP 55.57,54.21 CP2102.3 53.73,52.36 53.29,52.36 52.57,53.08 52.57,53.47 CP2102.M
  Bottom 0.305: C5.2 C6.2 56.42,55.76 C7.1 57.93,57.28 57.93,57.91 v56.86,58.98 v56.85,58.98 C29.-
  other vias: 61.69,16.15 59.88,14.48 58.23,12.98 57.05,11.85 55.76,10.56 54.52,9.25 62.84,17.15 65.12,19.41 66.33,20.5 43.15,36.43
  pour Bottom: -7,82 -7,-10 1,-10 82,-10 82,3 82,82
  pour Top: -4,-4 -4,78 8,78 78,78 78,64 78,30.8 66.3,19.1 43.2,-4
IO0  (via drill 0.35)
  Top 0.305: C25.1 32.88,47.7 R24.2 32.91,49.42 32.34,49.99 28.33,49.99 27.75,49.41 v27.75,48.09 | R23.1 16.42,54.89 14,52.47 14,49.61 | T4.C 45.63,54.91 45.08,54.91 44.34,55.65 44.34,56.52 43.84,57.02 | v27.76,51.85 35.89,51.85 | v27.75,48.08 U5.25
  Top 0.61: v43.82,57.04 43.84,57.02 | v35.91,51.85 35.89,51.85 | v27.75,51.86 v27.76,51.85 | v14,49.59 14,49.61 | v27.75,48.09 v27.75,48.08
  Bottom 0.305: 43.8,57.04 42.42,57.04 42.16,56.78 42.16,52.76 41.25,51.85 35.93,51.85 | 27.75,49.33 27.75,49.58 | 27.75,49.58 27.75,49.89 | v27.75,51.85 27.75,49.89 | v14.01,49.59 27.45,49.59 | 27.45,49.59 27.75,49.59 27.75,49.58 | 27.75,49.89 27.45,49.59 | 27.45,49.59 27.71,49.33 27.75,49.33 | v27.75,48.1 27.75,49.33
  Bottom 0.61: v14,49.59 v14.01,49.59 | v27.75,48.09 v27.75,48.1 | v27.75,51.86 v27.75,51.85 | v35.91,51.85 35.93,51.85 | v43.82,57.04 43.8,57.04
IO2  (via drill 0.35)
  Top 0.305: U5.24 29.36,43.32 R31.2 v32.88,41.68 | LED-1.A v53.62,35.5 v53.61,35.51
  Top 0.61: v32.88,41.67 v32.88,41.68
  Bottom 0.305: v53.61,35.51 45.44,35.51 42.65,32.72 42.65,28.37 42.04,27.76 34.19,27.76 32.88,29.07 32.88,41.65
  Bottom 0.61: v32.88,41.67 32.88,41.65
IO4-NRF-CE  (via drill 0.35)
  Top 0.254: U2.1 59,27.04 v59.25,27.04 | v26.48,43.55 U5.26
  Top 0.61: v26.48,43.54 v26.48,43.55 | v59.25,27.04
  Bottom 0.254: v59.24,27.03 54.38,22.17 26.89,22.17 25.26,23.8 25.26,41.43 26.48,42.65 26.48,43.52
  Bottom 0.61: v26.48,43.54 26.48,43.52 | v59.25,27.04 v59.24,27.03
IO5  (via drill 0.35)
  Top 0.305: 22.68,48.52 U5.29
  Top 0.61: v22.68,48.54 22.68,48.52
  Bottom 0.305: v22.69,48.53 R30.2
  Bottom 0.61: v22.68,48.54 v22.69,48.53
IO12-SPI-MISO  (via drill 0.35)
  Top 0.254: U2.5 56.75,27.62 56.75,27.98 v56.17,28.55 | v27.74,26.7 27.74,28.48 U5.14
  Top 0.61: v27.74,26.69 v27.74,26.7 | v56.17,28.56 v56.17,28.55
  Bottom 0.254: v56.16,28.55 51,23.39 28.8,23.39 27.74,24.45 27.74,26.66
  Bottom 0.61: v56.17,28.56 v56.16,28.55 | v27.74,26.69 27.74,26.66
IO13-SPI-MOSI  (via drill 0.35)
  Top 0.254: U2.4 57.34,27.5 57.34,28.68 56.9,29.11 | 31.16,33.05 U5.16
  Top 0.61: v31.2,33.05 31.16,33.05 | v56.88,29.13 56.9,29.11
  Bottom 0.254: 56.87,29.14 56.51,29.51 55.99,29.51 50.28,23.8 31.83,23.8 31.2,24.43 31.2,33.03
  Bottom 0.61: v56.88,29.13 56.87,29.14 | v31.2,33.05 31.2,33.03
IO14-SPI-SCK  (via drill 0.35)
  Top 0.254: U2.3 58,27.45 58,28.33 | 26.48,26.6 U5.13
  Top 0.61: v26.48,26.55 26.48,26.6 | v58,28.36 58,28.33
  Bottom 0.254: v57.99,28.36 52.62,22.98 27.78,22.98 26.48,24.28 v26.48,26.54
  Bottom 0.61: v58,28.36 v57.99,28.36 | v26.48,26.55 v26.48,26.54
IO15-NRF-CS  (via drill 0.35)
  Top 0.254: U2.2 58.66,27.4 58.66,27.71 | 31.02,41.94 U5.23
  Top 0.61: v31.05,41.94 31.02,41.94 | v58.66,27.73 58.66,27.71
  Bottom 0.254: 58.65,27.72 53.5,22.58 27.18,22.58 25.72,24.04 25.72,41.01 26.65,41.94 31.03,41.94
  Bottom 0.61: v31.05,41.94 31.03,41.94 | v58.66,27.73 58.65,27.72
IO18-I2C-SCL  (via drill 0.35)
  Top 0.254: v44.41,38.49 44.39,38.49 44.36,38.52 MPU5060.23
  Top 0.305: 44.44,38.49 46.3,38.49 | 46.3,38.49 46.62,38.49 | 46.62,38.49 46.91,38.49 | 46.91,38.49 48.41,38.49 BME280.4 | R9.1 46.61,38.8 | 46.61,38.79 46.61,38.5 46.62,38.49 | 46.61,38.8 46.3,38.49 | 46.61,38.8 46.61,38.79 | 46.61,38.79 46.91,38.49 | U5.30 21.41,49.1 22.75,50.45 41.73,50.45 43.31,48.87 43.31,45.24
  Top 0.61: v44.41,38.49 44.44,38.49 | v43.29,45.22 43.31,45.24
  Bottom 0.305: 44.39,38.49 43.72,38.49 43.29,38.92 43.29,45.19
  Bottom 0.61: v44.41,38.49 44.39,38.49 | v43.29,45.22 43.29,45.19
IO19-I2C-SDA  (via drill 0.35)
  Top 0.254: MPU5060.24 43.94,39.02 44.49,39.57 44.49,39.58 | 44.49,39.58 44.49,39.79 | 44.49,39.79 R10.1 | 44.49,39.58 44.5,39.59 44.69,39.59 | 45.32,39.59 44.69,39.59 | v45.59,37.8 BME280.3 | 44.69,39.59 44.49,39.79
  Top 0.305: U5.31 20.14,49.74 21.45,51.06 42.6,51.06 44.44,49.22 44.44,45.24
  Top 0.61: v45.34,39.59 45.32,39.59 | v45.58,37.8 v45.59,37.8 | v44.44,45.22 44.44,45.24
  Bottom 0.254: v45.34,39.59 45.34,38.04 v45.57,37.81
  Bottom 0.305: 44.44,45.2 44.44,39.92 44.77,39.59 v45.33,39.59
  Bottom 0.61: v45.58,37.8 v45.57,37.81 | v45.34,39.59 v45.33,39.59 | v44.44,45.22 44.44,45.2
IO21-ESC-1  (via drill 0.35)
  Top 0.305: U5.33 17.59,52.05 19.58,54.04 41.38,54.04
  Top 0.61: v41.4,54.04 41.38,54.04
  Bottom 0.305: 41.4,54.06 41.4,61.91
  Bottom 0.61: v41.4,54.04 41.4,54.06
  Bottom 1.27: ESC-1.2 41.46,61.97 41.4,61.91
IO22-MEMS-INT  (via drill 0.35)
  Top 0.254: 34.81,36.52 MPU5060.12
  Top 0.305: U5.36 13.79,48.23 12.66,49.35 12.66,51.37 12.65,51.38 | 30.47,44.63 30.47,47.29
  Top 0.61: v30.47,47.34 30.47,47.29 | v12.67,51.39 12.65,51.38 | v30.47,44.59 30.47,44.63 | v34.79,36.5 34.81,36.52
  Bottom 0.254: 34.79,36.52 34.79,43.57 33.77,44.59 30.49,44.59
  Bottom 0.305: v12.67,51.4 12.67,52.21 13.45,52.99 28.33,52.99 30.47,50.85 v30.47,47.35
  Bottom 0.61: v12.67,51.39 v12.67,51.4 | v30.47,47.34 v30.47,47.35 | v34.79,36.5 34.79,36.52 | v30.47,44.59 30.49,44.59
IO25-ESC-2
  Top 0.305: U5.10 22.68,18.59 24.81,16.45 32.62,16.45 33.69,15.38 33.69,12.78
  Top 1.27: ESC-2.2 33.69,12.78
IO26-ESC-3
  Top 0.305: ESC-3.2 41.64,18.63 40.24,20.03 25.43,20.03 23.95,21.52 U5.11
  Top 1.27: ESC-3.2
IO27-ESC-4  (via drill 0.35)
  Top 0.305: 25.21,44.17 U5.12
  Top 0.61: v25.26,44.22 25.21,44.17
  Bottom 0.305: 33.5,62.17 33.5,46.93 32.36,45.79 25.96,45.79 25.26,45.09 v25.26,44.23
  Bottom 0.61: v25.26,44.22 v25.26,44.23
  Bottom 1.27: ESC-4.2 33.5,62.17
IO32-NRF-IRQ  (via drill 0.35)
  Top 0.254: 52.86,28.42 U2.6 | 32.31,21.48 32.31,24.62 | 20.14,26.68 U5.8
  Top 0.61: v20.15,26.67 20.14,26.68 | v32.31,24.67 32.31,24.62 | v32.31,21.43 32.31,21.48 | v52.86,28.44 52.86,28.42
  Bottom 0.254: 52.84,28.46 50.37,30.93 47.75,30.93 47.19,30.37 47.19,25.39 46.03,24.23 32.75,24.23 v32.32,24.66 | v32.3,21.43 21.46,21.43 20.15,22.74 20.15,26.65
  Bottom 0.61: v52.86,28.44 52.84,28.46 | v32.31,24.67 v32.32,24.66 | v32.31,21.43 v32.3,21.43 | v20.15,26.67 20.15,26.65
IO33-USR-LED  (via drill 0.35)
  Top 0.305: U5.9 21.41,17.96 24.13,15.24 31.55,15.24 | 43.98,29.21 43.98,20.41 43.84,20.27 | 54.8,39.29 LED-2.A
  Top 0.61: v54.78,39.29 54.8,39.29 | v31.58,15.24 31.55,15.24 | v43.84,20.25 43.84,20.27 | v43.98,29.24 43.98,29.21
  Bottom 0.305: 31.58,15.26 31.58,18.09 33.74,20.25 43.82,20.25 | v43.99,29.25 43.99,30.96 44.95,31.92 52.81,31.92 54.78,33.89 v54.78,39.28
  Bottom 0.61: v54.78,39.29 v54.78,39.28 | v43.98,29.24 v43.99,29.25 | v31.58,15.24 31.58,15.26 | v43.84,20.25 43.82,20.25
IO35-LIPO
  Top 0.305: U5.7 18.86,12.99 17,11.13 R14.2 14.54,11.16 R13.1
LIPO+
  Top 0.813: 11.6,6.91 R13.2
  Top 1.27: LIPO+.1 11.6,6.91
LIPO-
  Top 0.813: 14.59,6.56 14.59,9.21 R14.1
  Top 1.27: LIPO-.1 14.59,6.56
N$3
  Top 0.254: U2.10 51.13,27.33 50.15,27.33 49.34,26.52
  Top 0.305: Q2.1 50.11,25.71 50.11,24.51 C14.2
  Top 1.27: Q2.1 49.34,26.52
N$4
  Top 0.254: U2.9 51.51,27.65 51.51,28.69 Q2.2
  Top 0.305: C15.2 55.59,29.13 53.52,29.13 52.75,29.89
  Top 1.27: Q2.2 52.75,29.89
N$5
  Top 0.305: R1.1 LED-2.C
N$7
  Top 0.254: C17.2 59.72,19.76 59.99,19.76 61.15,18.6 61.43,18.6 62.1,19.27 C16.2 62.12,19.46 E1.ANT
N$8
  Top 0.305: BME280.2 45.89,37.15 44.16,35.42 R11.1
N$9  (via drill 0.35)
  Top 0.254: U2.16 57.29,21.17 58.34,21.17 59.37,22.19 61.92,22.19 62.23,22.5
  Top 0.61: v62.24,22.51 62.23,22.5
  Bottom 0.254: v62.24,22.52 63.2,23.47 R2.2
  Bottom 0.61: v62.24,22.51 v62.24,22.52
N$10
  Top 0.254: MPU5060.10 34.52,37.52 34.09,37.09 C30.2
N$11  (via drill 0.35)
  Top 0.254: U2.19 57.86,22.72 61.16,22.72 61.54,23.1
  Top 0.61: v61.55,23.11 61.54,23.1
  Bottom 0.254: 61.53,23.12 60.8,23.86 60.8,24.45 C13.2
  Bottom 0.61: v61.55,23.11 61.53,23.12
N$12
  Top 0.254: U2.11 52.67,23.54 51.73,23.54 49.21,21.02 49.21,19.96 52.53,16.64 53.26,16.64 L2.2
  Top 0.305: C19.2 57.23,17.34 C18.2 55.57,15.74 L2.2
N$13
  Top 0.254: U2.13 52.35,21.8
  Top 0.305: L3.1 53.83,20.31 L1.1 52.35,21.8
N$14
  Top 0.254: U2.12 52.97,23.13 51.9,23.13 50.28,21.51 50.28,21.03 L1.2
  Top 0.305: L2.1 L1.2
N$15
  Top 0.254: MPU5060.20 41.67,37.02 41.89,36.8 C4.2
N$17
  Top 0.254: C16.1 60.04,21.52 59.58,21.52 56.4,18.34 56.08,18.34 L3.2
N$19
  Top 0.305: BME280.5 51.26,38.45 51.57,38.76 51.57,41 51.2,41.37 R12.2
N$21
  Top 0.305: CP2102.9 58.69,50.39 R3.1
N$22
  Top 0.508: BOOT.2 C10.2 R23.2
N$23
  Top 0.305: T3.B 52.77,60.56 R26.1
N$24
  Top 0.305: T4.B 48.53,59.15 R27.1
N$25
  Top 0.305: LED-1.C 60.67,35.5 R25.1
N$26
  Top 0.305: R22.2 C9.2 RESET.2
N$27
  Top 0.254: X2.1 62.81,60.22 62.81,59.63 FERRIT1.1
N$28
  Top 0.254: X2.2 60.7,59.24 60.7,56.78 64.38,53.1 64.38,48.87 60.87,45.36 56.94,45.36 53.24,49.06 53.24,50.46 CP2102.5
N$29  (via drill 0.35)
  Top 0.254: X2.3 60.27,59.95 60.27,56.6 63.97,52.9 63.97,49.06 60.69,45.78 57.56,45.78 v54.06,49.28 | 52.5,49.79 52.5,50.43 CP2102.4
  Top 0.61: v54.05,49.29 v54.06,49.28 | v52.5,49.77 52.5,49.79
  Bottom 0.254: v54.05,49.3 53.57,49.77 52.52,49.77
  Bottom 0.61: v54.05,49.29 v54.05,49.3 | v52.5,49.77 52.52,49.77
N$30
  Top 0.305: USB-PWR-LED.A 58.5,61.87 R4.2
RTS  (via drill 0.35)
  Top 0.305: T3.E 51.12,62.13 R27.2 49.87,60.9 v48.76,62.02 | CP2102.24 53.43,57.77 v52.41,57.77
  Top 0.61: v52.4,57.77 v52.41,57.77 | v48.75,62.02 v48.76,62.02
  Bottom 0.305: 52.4,57.79 52.4,58.38 v48.76,62.02 v48.75,62.02
  Bottom 0.61: v52.4,57.77 52.4,57.79
RXD
  Top 0.305: CP2102.25 53.44,57.05 51.7,57.05 R29.1
RXD0
  Top 0.305: U5.34 16.32,52.1 19,54.78 41.92,54.78 46.67,50.03 47.71,50.03 R28.2
TXD
  Top 0.305: CP2102.26 53.37,56.41 52.16,56.41 51.36,55.61 51.36,53.68 R28.1
TXD0
  Top 0.305: U5.35 15.05,52.01 18.33,55.28 42.36,55.28 45.72,51.92 46.57,51.92 R29.2
VBUS  (via drill 0.35)
  Top 0.254: FERRIT1.2 D2.A
  Top 0.305: 61.44,47.61 R3.2 61.3,50.28 | 61.91,47.61 63.54,49.24 63.54,52.72 59.84,56.42 59.84,60.12 61.03,61.32 61.03,61.95 R4.1 60.91,64.2 | 61.91,47.61 61.44,47.61 | v66.01,59.07 FERRIT1.2 | CP2102.7 54.93,50.74 54.93,49.02 55.02,48.92 | 61.48,47.18 60.51,46.21 57.74,46.21 55.47,48.48 | 61.48,47.18 61.91,47.61 | 55.02,48.92 55.19,48.77 | 55.19,48.77 55.47,48.48 | 61.44,47.61 61.48,47.57 61.48,47.18 | CP2102.8 57.29,51.08 57.29,50.83 55.44,48.98 | 55.19,48.77 55.23,48.77 55.44,48.98 | 55.44,48.98 55.08,48.98 55.02,48.92 | 55.44,48.98 55.47,48.95 55.47,48.48
  Top 0.61: v66.01,59.07 | v60.93,64.23 60.91,64.2 | v61.32,50.3 61.3,50.28
  Bottom 0.305: v60.94,64.22 66.01,59.15 66.01,59.09 | C6.1 58.09,51.4 C5.1 60.05,49.44 60.45,49.44 v61.31,50.3
  Bottom 0.61: v66.01,59.07 66.01,59.09 | v60.93,64.23 v60.94,64.22 | v61.32,50.3 v61.31,50.3

### Text on the board
tPlace: GND | ESC | 5V | GND | ESC | 5V | Finance By / Berkay H. | ESC | 5V | Designed By / Turgay H. | GND | GND | ESC | 5V | Referenced By / Yunus Emre H.
bPlace: DroneMainBoard V1.1